# EAGLE board snowflake-hw-v0.0.2 R5 (EAGLE 9.2.2)
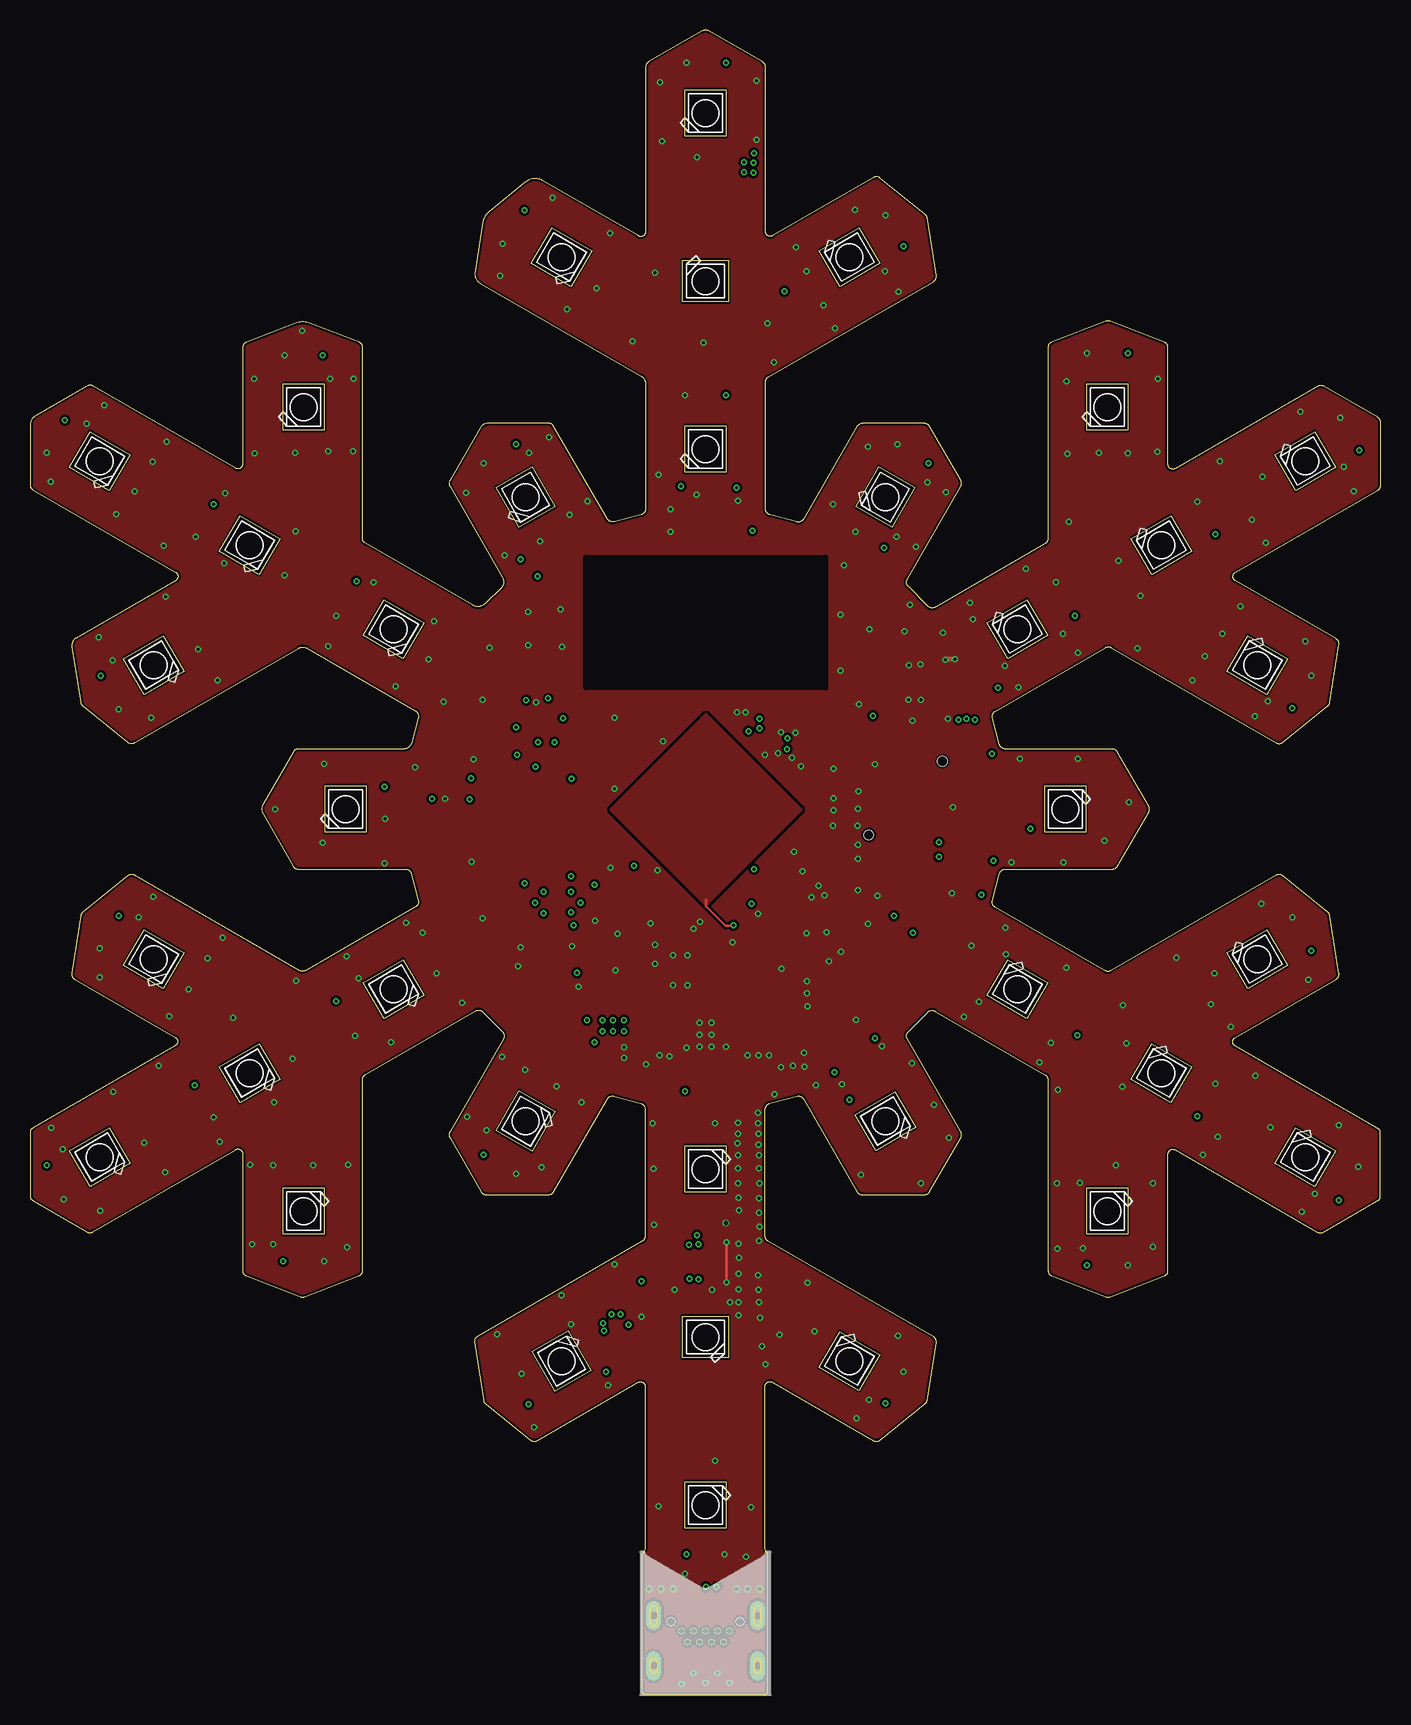
[diagram p2: board, top side]
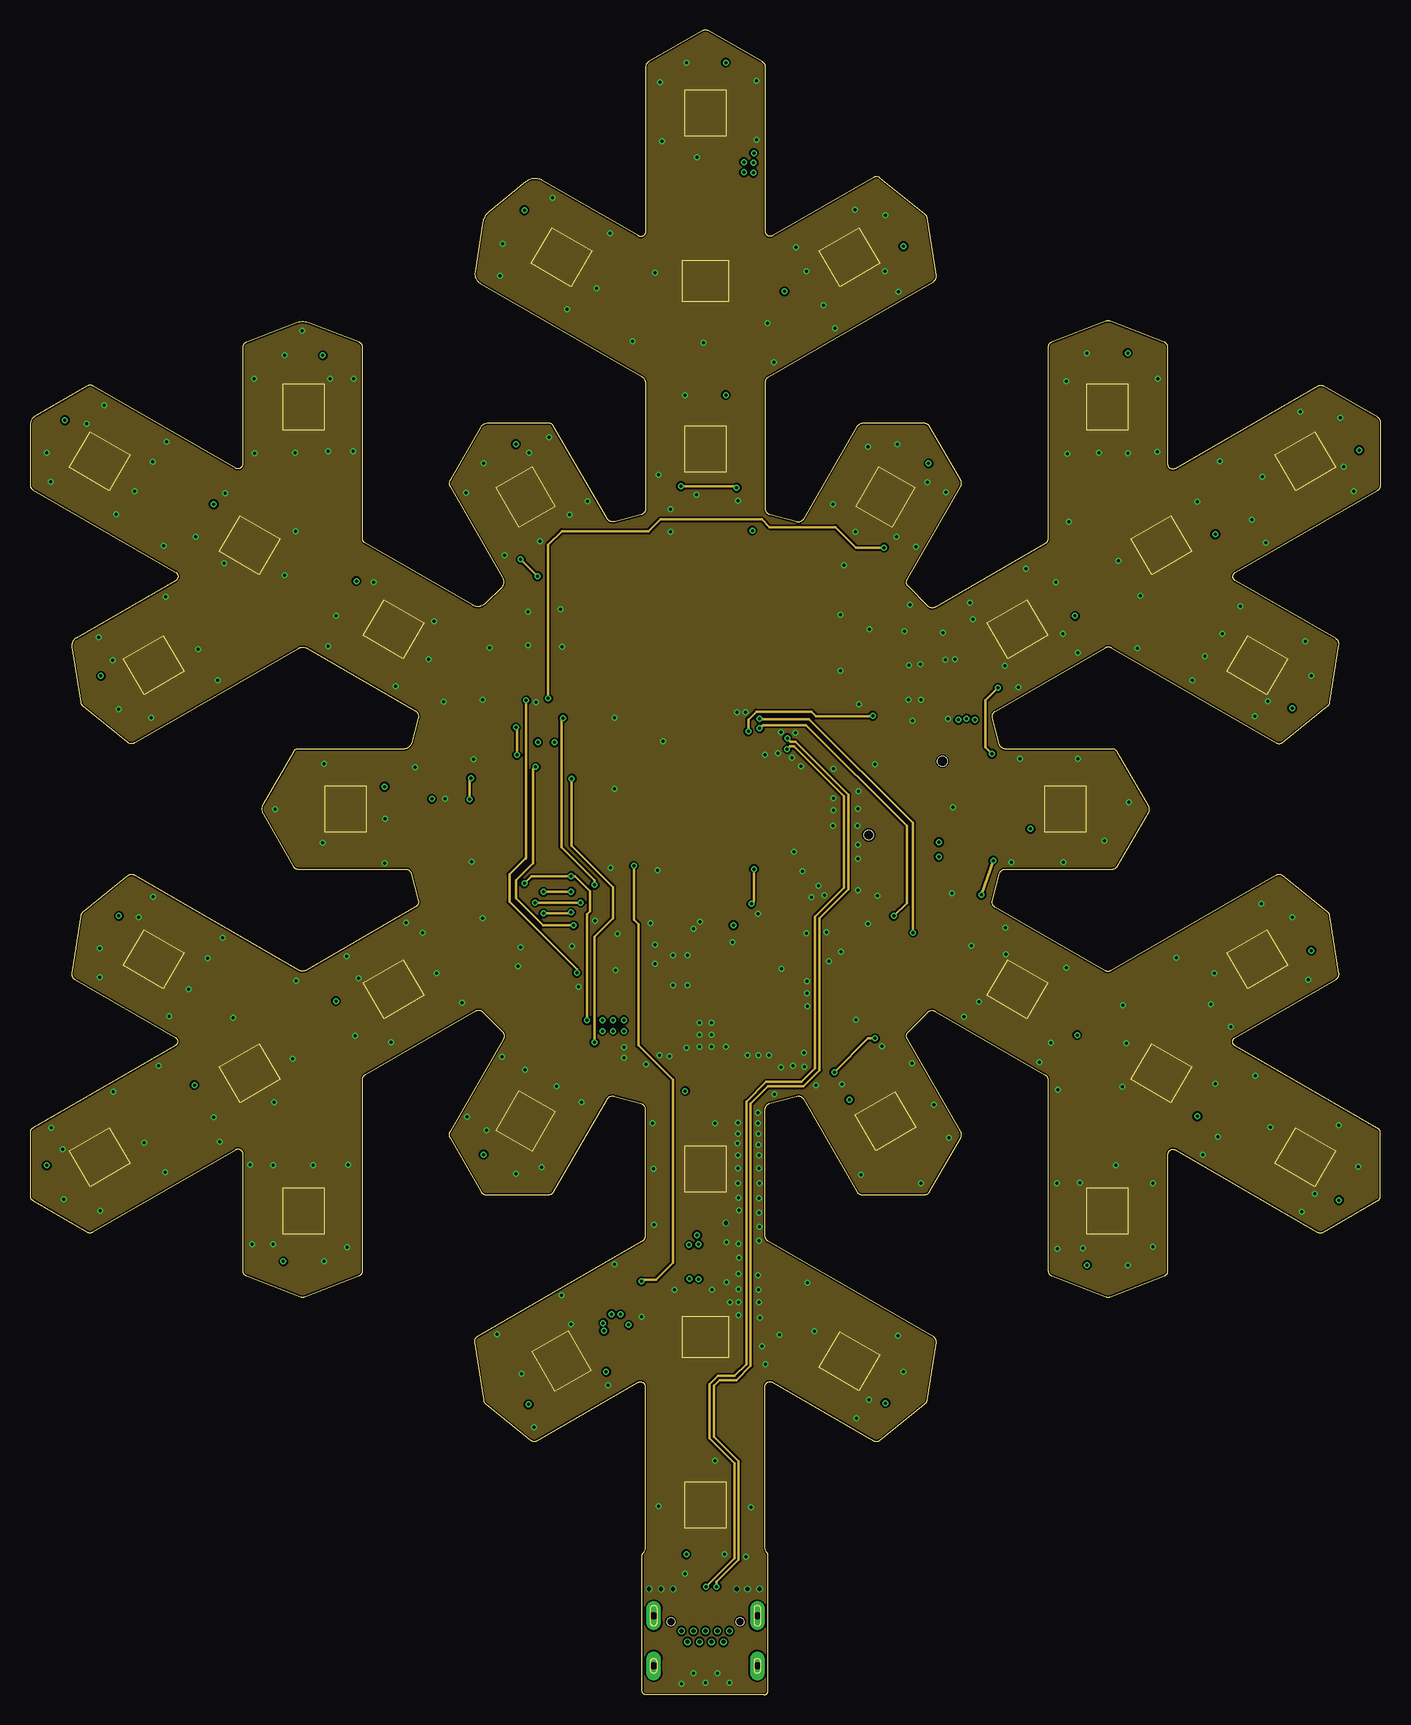
[diagram p3: board, inner layer Route2]
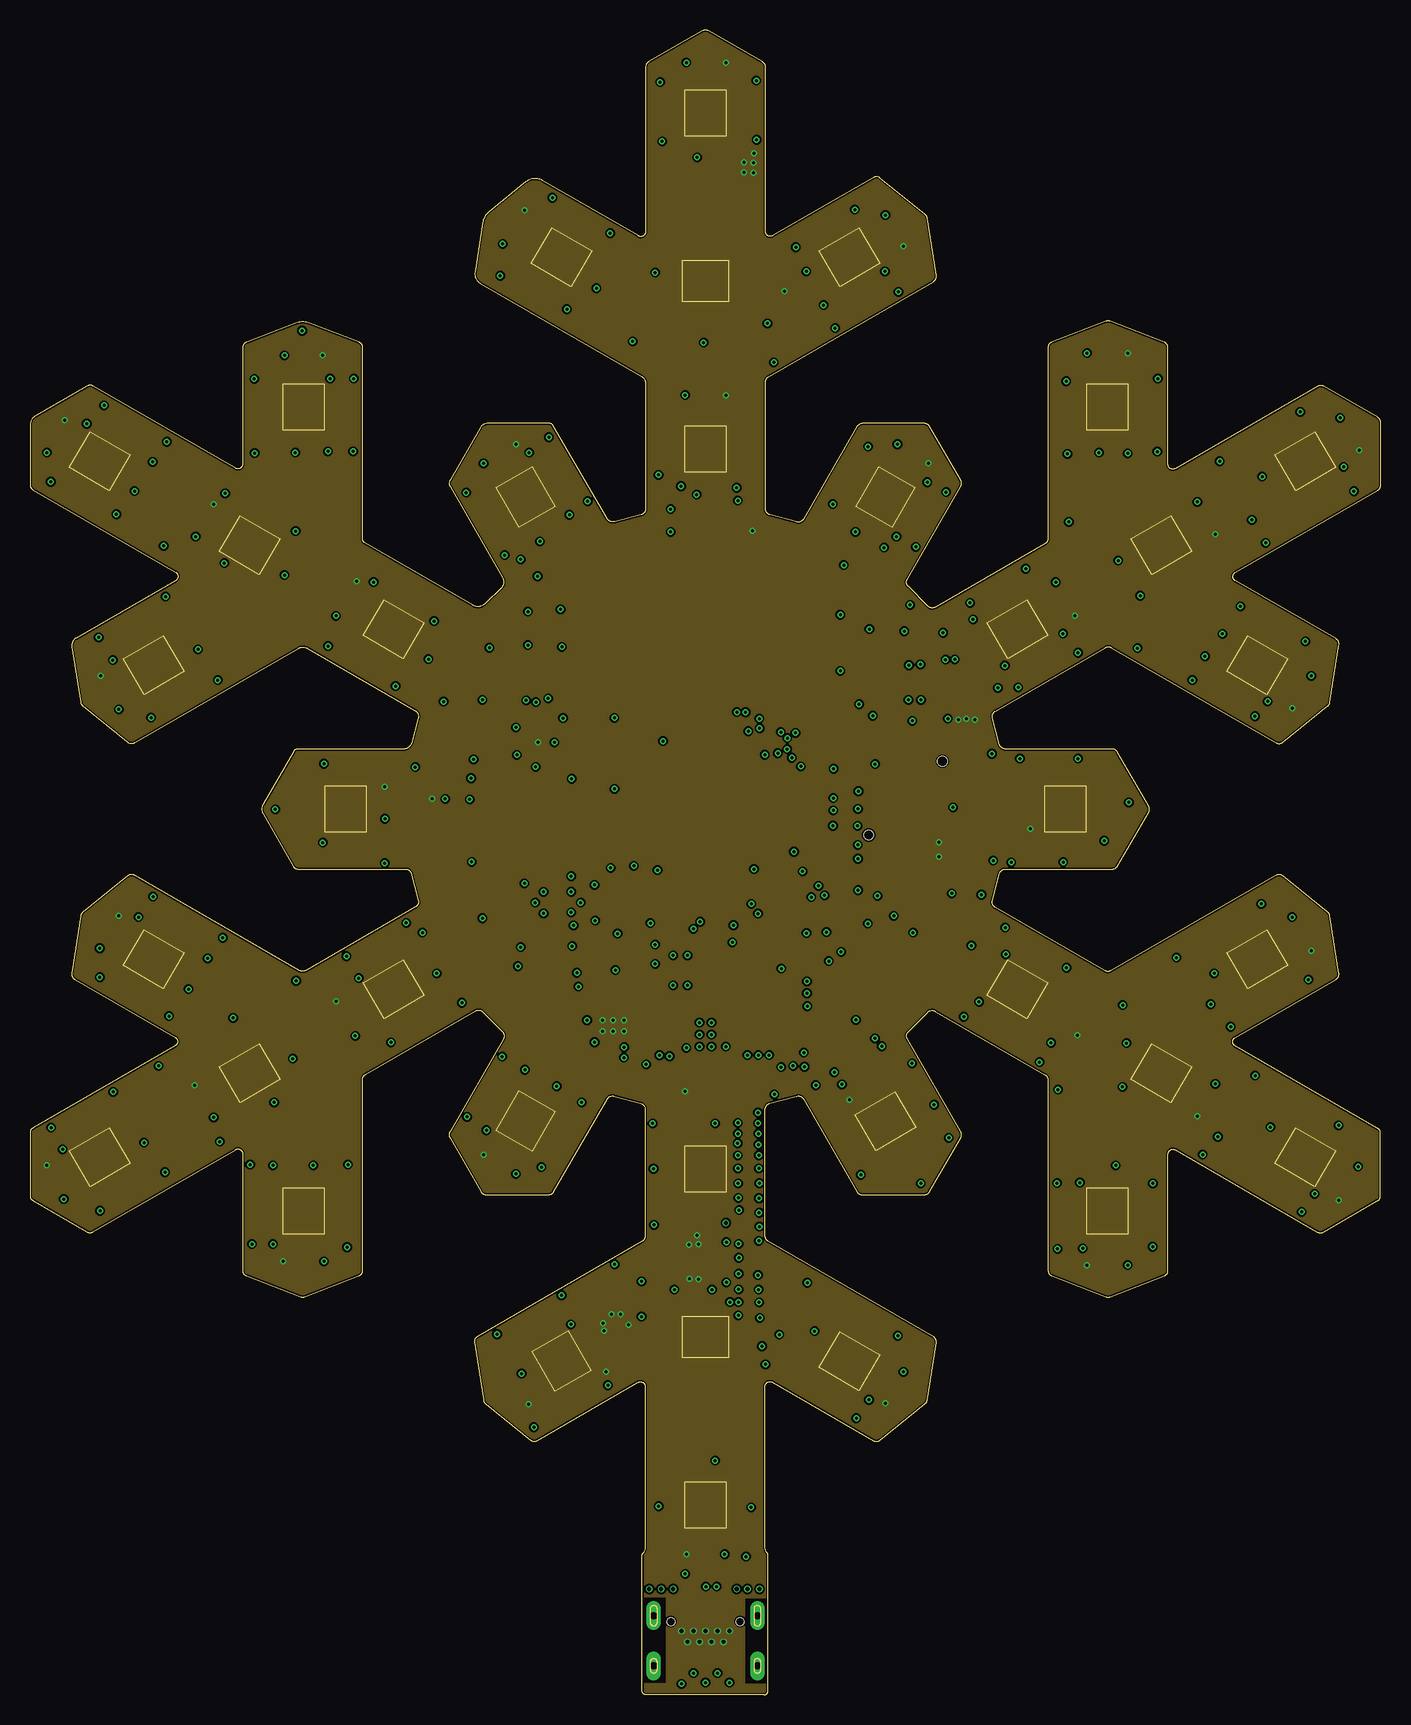
[diagram p4: board, inner layer Route15]
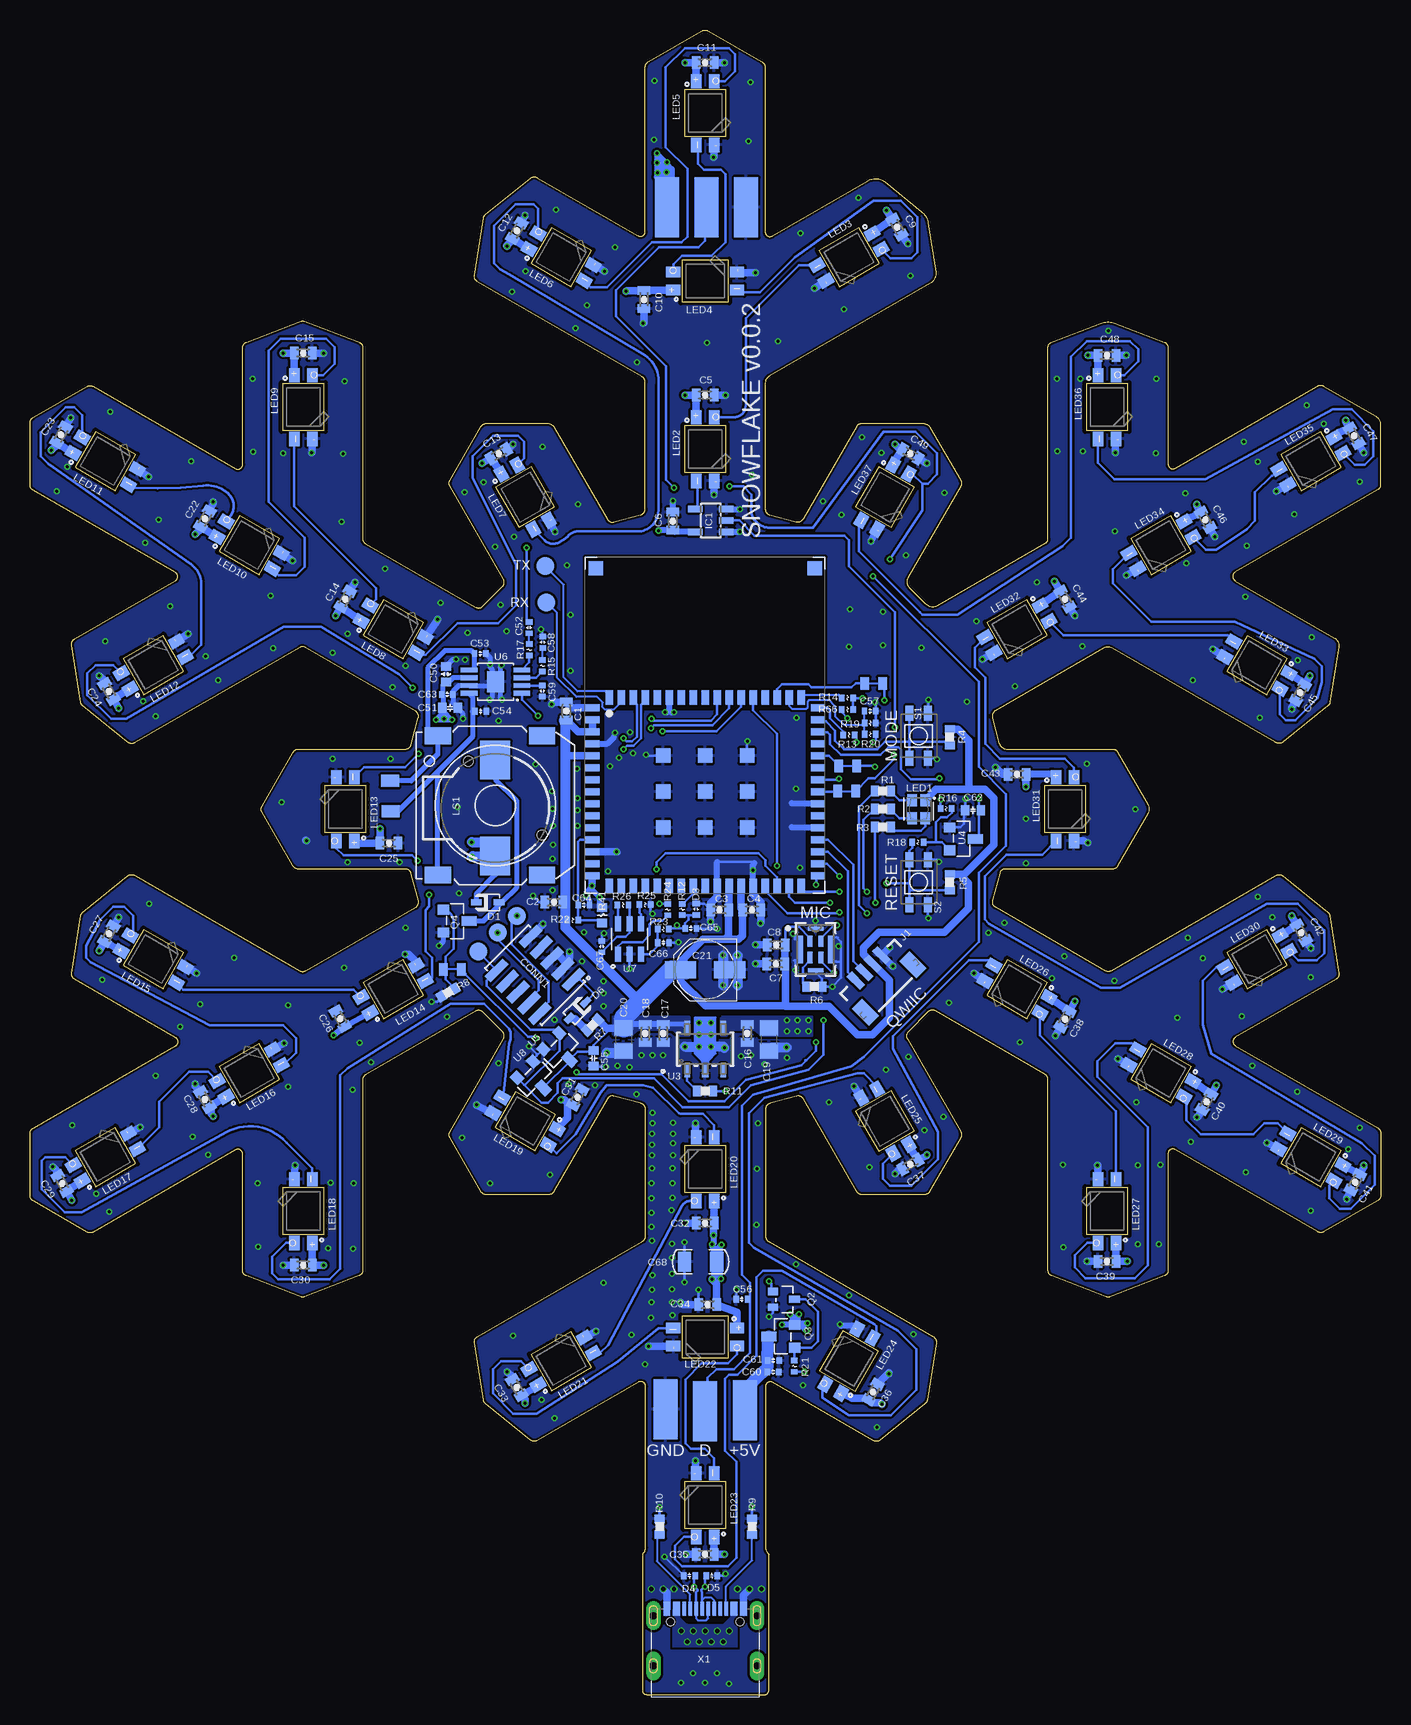
[diagram p5: board, bottom side, seen from below]

Size 112.6 x 138.75 mm. Coordinates in mm from the lower left corner, seen from the top.
Outline: 244 segments
Copper layers (1+2*15+16): Top 0.018mm / dielectric 0.195mm / Route2 0.035mm / dielectric 1.1mm / Route15 0.035mm / dielectric 0.195mm / Bottom 0.018mm
Design rules "particle-4layer *": minimum track width 6mil, minimum drill 0.25mm, track to track 6mil, track to pad 6mil, pad to pad 6mil, via to via 6mil, smd to smd 0mil, copper to edge 6mil, drill to drill 6mil, minimum pad ring 12mil, minimum via ring 4mil, stop-mask expansion 0.01mm, vias tented up to drill 20mil, thermal gap 8mil
Net classes: 0 default: width 0.152 mm, clearance 0.152 mm

## Footprints (pad centres in the part's own frame; a part is rotated, then mirrored left to right if it is on the bottom)
TP_2X5MM = smd 2 x 5: P$1 0,0
C0603_P = smd 0.711 x 1.041: 1 -0.749,0; 2 0.749,0
C0805 = smd 1.3 x 1.5: 1 -0.95,0; 2 0.95,0
PANASONIC_C = smd 2.6 x 1.4: + 2.05,0; - -2.05,0
C0603 = smd 0.7 x 0.85: 1 -0.65,0; 2 0.65,0
C-0603A = smd 0.7 x 0.85: 1 -0.65,0; 2 0.65,0
C-0402 = smd 0.45 x 0.55: 1 -0.47,0; 2 0.47,0
C1206 = smd 1.1 x 1.65: 1 -1.35,0; 2 1.35,0
CONN5X2_1.27 = smd 0.7 x 2.1: 1 -2.54,-2; 2 -2.54,2; 3 -1.27,-2; 4 -1.27,2; 5 0,-2; 6 0,2; 7 1.27,-2; 8 1.27,2; 9 2.54,-2; 10 2.54,2
SOD-323 = smd 0.9 x 0.5: 1 -0.95,0; 2 0.95,0
C0402 = smd 0.45 x 0.6: 1 -0.47,0; 2 0.47,0
SOT23-5L = smd 0.55 x 1.2: 1 -0.95,-1.3; 2 0,-1.3; 3 0.95,-1.3; 4 0.95,1.3; 5 -0.95,1.3
JST04_1MM_VERT = smd 0.6 x 1.55: 1 -1.5,0.775; 2 -0.5,0.775; 3 0.5,0.775; 4 1.5,0.775 | smd 1.2 x 2: NC1 -2.8,3.2; NC2 2.8,3.2
PLCC4-2MM-RGB = smd 1 x 0.8: BLUE -0.75,-0.55; CA 0.75,-0.55; GREEN -0.75,0.55; RED 0.75,0.55
NEO3535_REVERSE = smd 1.2 x 0.9 bottom: 1-VDD 2.65,-0.75; 2-DOUT 2.65,0.75; 3-GND -2.65,0.75; 4-DIN -2.65,-0.75
BUZZER-CCV = smd 3.2 x 2.5: + 4,0; - -4,0 | hole 0.8: -3.9,-2.25; 2.25,3.9
SOT323 = smd 0.6 x 0.8: 1 -0.65,-0.95; 2 0.65,-0.95 | smd 0.6 x 0.9: 3 0,0.85
SOT-23 = smd 0.8 x 0.95: 1 -0.95,-1; 2 0.95,-1 | smd 0.8 x 1.25: 3 0,1.15
R0603_P = smd 0.7 x 0.85: 1 -0.65,0; 2 0.65,0
R-0402S = smd 0.45 x 0.55: 1 -0.47,0; 2 0.47,0
R-0603A = smd 0.7 x 0.85: 1 -0.65,0; 2 0.65,0
TACTILE_SWITCH_SMD = smd 1.25 x 0.65: 1 -1.875,0.775; 2 1.875,0.775; 3 -1.875,-0.775; 4 1.875,-0.775
TP = smd 1.5 x 1.5: TP 0,0
TP-1.0X1.5 = smd 1.5 x 1: P$1 0,0
P2 = smd 1.2 x 0.6: 1 -9.4,2.45; 2 -9.4,1.45; 3 -9.4,0.45; 4 -9.4,-0.55; 5 -9.4,-1.55; 6 -9.4,-2.55; 7 -9.4,-3.55; 8 -9.4,-4.55; 9 -9.4,-5.55; 10 -9.4,-6.55; 11 -9.4,-7.55; 12 -9.4,-8.55; 13 -9.4,-9.55; 14 -9.4,-10.55; 15 -9.4,-11.55; 33 9.4,-11.55; 34 9.4,-10.55; 35 9.4,-9.55; 36 9.4,-8.55; 37 9.4,-7.55; 38 9.4,-6.55; 39 9.4,-5.55; 40 9.4,-4.55; 41 9.4,-3.55; 42 9.4,-2.55; 43 9.4,-1.55; 44 9.4,-0.55; 45 9.4,0.45; 46 9.4,1.45; 47 9.4,2.45 | smd 0.6 x 1.2: 16 -8,-12.4; 17 -7,-12.4; 18 -6,-12.4; 19 -5,-12.4; 20 -4,-12.4; 21 -3,-12.4; 22 -2,-12.4; 23 -1,-12.4; 24 0,-12.4; 25 1,-12.4; 26 2,-12.4; 27 3,-12.4; 28 4,-12.4; 29 5,-12.4; 30 6,-12.4; 31 7,-12.4; 32 8,-12.4; 48 8,3.3; 49 7,3.3; 50 6,3.3; 51 5,3.3; 52 4,3.3; 53 3,3.3; 54 2,3.3; 55 1,3.3; 56 0,3.3; 57 -1,3.3; 58 -2,3.3; 59 -3,3.3; 60 -4,3.3; 61 -5,3.3; 62 -6,3.3; 63 -7,3.3; 64 -8,3.3 | smd 1.2 x 1.2: 65 -3.5,-1.55; 66 -3.5,-4.55; 67 -3.5,-7.55; 68 0,-1.55; 69 0,-4.55; 70 0,-7.55; 71 3.5,-1.55; 72 3.5,-4.55; 73 3.5,-7.55; 74 9.12,14.07; 75 -9.12,14.07
MP34DT05TR-A_STM = smd 0.406 x 0.94: 1 -0.45,0.675; 2 -0.45,-0.675; 3 0.45,-0.675; 4 0.45,0.675 | smd 1.295 x 0.356: 5 0,1.725; 6 0,-1.725 | smd 0.356 x 2.311: 7 -1.225,0; 8 1.225,0
SOT-89-5_TOR-M = smd 0.483 x 1.118: 1 -1.5,-1.803; 3 1.5,-1.803; 4 1.5,1.803; 5 -1.5,1.803 | smd 0.533 x 1.118: 2 0,-1.803
MSOP-8 = smd 1.4 x 0.4: 1 -2.2,0.975; 2 -2.2,0.325; 3 -2.2,-0.325; 4 -2.2,-0.975; 5 2.2,-0.975; 6 2.2,-0.325; 7 2.2,0.325; 8 2.2,0.975 | smd 1.425 x 1.76: 9 0,0
SOT-23-6 = smd 1.27 x 0.508: 1 -1.27,0.953; 2 -1.27,0; 3 -1.27,-0.953; 4 1.27,-0.953; 5 1.27,0; 6 1.27,0.953
KJL-01304T(13X13MM) = smd 1.4 x 2.2: LEAD+ -5.8,-4.8; LEAD- 5.8,-4.8; P$1 -5.8,3.9; P$2 5.8,3.9
JMP_0603_NC = smd 0.711 x 1.041: 1 -0.749,0; 2 0.749,0
USB_C_CUSB31-CFM2AX-01-X = smd 0.575 x 1.15: A1B12 -3.2,7.355; A4B9 -2.4,7.355; B1A12 3.2,7.355; B4A9 2.4,7.355 | smd 0.275 x 1.15: A5 -1.25,7.355; A6 -0.25,7.355; A7 0.25,7.355; A8 1.25,7.355; B5 1.75,7.355; B6 0.75,7.355; B7 -0.75,7.355; B8 -1.75,7.355 | drill 0.6 pad 1 long: M1 -4.32,6.78; M2 4.32,6.78; M3 -4.32,2.6; M4 4.32,2.6 | hole 0.65: 2.89,6.28; -2.89,6.28

## Placement (x,y rotation side)
+5V  TP2X5MM  [TP_2X5MM]  59.5,123.96 0 bottom
+5V_EX  TP2X5MM  [TP_2X5MM]  53.01,23.73 0 bottom
C1  0.1uF, 16V  [C0603_P]  67.88,82 90 bottom
C2  0.1uF, 16V  [C0603_P]  68.91,66.07 180 bottom
C3  0.1uF, 16V  [C0603_P]  55.11,65.43 180 bottom
C4  0.1uF, 16V  [C0603_P]  52.41,65.43 0 bottom
C5  0.1uF, 16V  [C0603_P]  56.31,108.33 180 bottom
C6  0.1uF, 16V  [C0603_P]  59.01,97.83 270 bottom
C7  0.1uF, 16V  [C0603_P]  50.41,60.93 180 bottom
C8  10uF, 16V  [C0603_P]  50.38,62.5 180 bottom
C9  0.1uF, 16V  [C0603_P]  40.31,122.33 120 bottom
C10  0.1uF, 16V  [C0603_P]  61.41,116.29 90 bottom
C11  0.1uF, 16V  [C0603_P]  56.31,136.03 180 bottom
C12  0.1uF, 16V  [C0603_P]  72.01,122.03 240 bottom
C13  0.1uF, 16V  [C0603_P]  73.51,103.43 210 bottom
C14  0.1uF, 16V  [C0603_P]  86.31,91.33 240 bottom
C15  0.1uF, 16V  [C0603_P]  89.81,111.83 180 bottom
C16  0.1uF, 16V  [C0603_P]  52.81,55.13 90 bottom
C17  0.1uF, 16V  [C0603_P]  59.81,55.13 90 bottom
C18  0.01uF, 16V  [C0603_P]  61.31,55.13 270 bottom
C19  22uF, 10V  [C0805]  51.01,54.63 270 bottom
C20  22uF, 10V  [C0805]  63.11,54.63 270 bottom
C21  100uF, 6.3V  [PANASONIC_C]  56.31,60.43 180 bottom
C22  0.1uF, 16V  [C0603_P]  98.01,98.03 240 bottom
C23  0.1uF, 16V  [C0603_P]  110.01,105.03 240 bottom
C24  0.1uF, 16V  [C0603_P]  106.01,83.63 300 bottom
C25  0.1uF, 16V  [C0603_P]  82.66,70.99 180 bottom
C26  0.1uF, 16V  [C0603_P]  86.73,56.35 300 bottom
C27  0.1uF, 16V  [C0603_P]  106.01,63.43 240 bottom
C28  0.1uF, 16V  [C0603_P]  98.01,49.63 300 bottom
C29  0.1uF, 16V  [C0603_P]  109.91,42.63 300 bottom
C30  0.1uF, 16V  [C0603_P]  89.81,35.83 0 bottom
C31  0.1uF, 16V  [C0603_P]  66.95,49.82 240 bottom
C32  0.1uF, 16V  [C0603_P]  56.31,39.33 0 bottom
C33  0.1uF, 16V  [C0603_P]  72.01,25.63 300 bottom
C34  0.1uF, 16V  [C0603_P]  56.1,32.53 0 bottom
C35  0.1uF, 16V  [C0603_P]  56.31,11.73 0 bottom
C36  0.1uF, 16V  [C0603_P]  42.32,25.25 240 bottom
C37  0.1uF, 16V  [C0603_P]  39.21,44.23 30 bottom
C38  0.1uF, 16V  [C0603_P]  26.31,56.33 60 bottom
C39  0.1uF, 16V  [C0603_P]  22.81,36.13 0 bottom
C40  0.1uF, 16V  [C0603_P]  14.51,49.43 60 bottom
C41  0.1uF, 16V  [C0603_P]  2.12,42.73 60 bottom
C42  0.1uF, 16V  [C0603_P]  6.61,63.53 120 bottom
C43  0.1uF, 16V  [C0603_P]  30.31,76.73 0 bottom
C44  0.1uF, 16V  [C0603_P]  26.31,91.33 120 bottom
C45  0.1uF, 16V  [C0603_P]  6.71,83.53 60 bottom
C46  0.1uF, 16V  [C0603_P]  14.61,97.93 120 bottom
C47  0.1uF, 16V  [C0603_P]  2.21,104.93 120 bottom
C48  0.1uF, 16V  [C0603_P]  22.81,111.63 180 bottom
C49  0.1uF, 16V  [C0603_P]  39.21,103.43 150 bottom
C50  0.1uF  [C0603]  77.91,85.07 90 bottom
C51  10uF  [C-0603A]  77.58,82.26 0 bottom
C52  1uF  [C-0402]  70.99,88.95 90 bottom
C53  nc  [C-0402]  75.06,86.78 180 bottom
C54  nc  [C-0402]  75.03,81.98 0 bottom
C55  0.1uF  [C-0603A]  65.62,53.07 90 bottom
C56  10pF  [C-0402]  53.25,32.98 0 bottom
C57  1000pF  [C-0402]  42.56,81.99 180 bottom
C58  1uF  [C-0402]  69.86,87.73 90 bottom
C59  0.22uF  [C-0402]  69.88,83.67 270 bottom
C60  0.1uF  [C-0402]  50.65,26.92 180 bottom
C61  1000F  [C-0402]  50.62,27.87 180 bottom
C62  0.1uF  [C-0603A]  33.97,73.73 0 bottom
C63  1000pF  [C-0402]  77.81,83.39 0 bottom
C64  1000PF  [C-0402]  66.42,65.82 180 bottom
C65  NC  [C-0402]  57.5,63.89 0 bottom
C66  33P  [C-0402]  59.79,62.69 180 bottom
C67  0.1uF  [C-0402]  64.92,62.37 270 bottom
C68  100uF  [C1206]  56.69,36.1 180 bottom
CONN1  CONN5X2  [CONN5X2_1.27]  70.49,60 135 bottom
D1  nc  [SOD-323]  74.43,66.05 180 bottom
D3  LXES15AAA1-133  [C0402]  57.06,65.48 90 bottom
D4  nc  [C0402]  57.62,9.94 180 bottom
D5  nc  [C0402]  55.76,9.94 0 bottom
D6  LRB551V-30  [SOD-323]  66.94,57.07 45 bottom
DATA  TP2X5MM  [TP_2X5MM]  56.31,23.65 0 bottom
DATA1  TP2X5MM  [TP_2X5MM]  56.2,123.96 0 bottom
GND  TP2X5MM  [TP_2X5MM]  59.61,23.81 0 bottom
GND115  TP2X5MM  [TP_2X5MM]  52.9,123.96 0 bottom
IC1  74AHC1G125  [SOT23-5L]  55.84,97.88 90 bottom
J1  [JST04_1MM_VERT]  43.24,61.14 225 bottom
LED1  RGB-LED-CLMVB-FKARGB  [PLCC4-2MM-RGB]  38.51,73.83 90 bottom
LED2  WS2812B_SK6812E  [NEO3535_REVERSE]  56.31,103.83 90 top
LED3  WS2812B_SK6812E  [NEO3535_REVERSE]  44.31,119.83 150 top
LED4  WS2812B_SK6812E  [NEO3535_REVERSE]  56.31,117.83 0 top
LED5  WS2812B_SK6812E  [NEO3535_REVERSE]  56.31,131.83 90 top
LED6  WS2812B_SK6812E  [NEO3535_REVERSE]  68.31,119.83 30 top
LED7  WS2812B_SK6812E  [NEO3535_REVERSE]  71.31,99.83 60 top
LED8  WS2812B_SK6812E  [NEO3535_REVERSE]  82.31,88.83 30 top
LED9  WS2812B_SK6812E  [NEO3535_REVERSE]  89.81,107.33 90 top
LED10  WS2812B_SK6812E  [NEO3535_REVERSE]  94.31,95.83 30 top
LED11  WS2812B_SK6812E  [NEO3535_REVERSE]  106.31,102.83 30 top
LED12  WS2812B_SK6812E  [NEO3535_REVERSE]  102.31,85.83 330 top
LED13  WS2812B_SK6812E  [NEO3535_REVERSE]  86.31,73.83 270 top
LED14  WS2812B_SK6812E  [NEO3535_REVERSE]  82.31,58.83 330 top
LED15  WS2812B_SK6812E  [NEO3535_REVERSE]  102.31,61.33 30 top
LED16  WS2812B_SK6812E  [NEO3535_REVERSE]  94.31,51.83 330 top
LED17  WS2812B_SK6812E  [NEO3535_REVERSE]  106.31,44.83 330 top
LED18  WS2812B_SK6812E  [NEO3535_REVERSE]  89.81,40.33 270 top
LED19  WS2812B_SK6812E  [NEO3535_REVERSE]  71.31,47.83 210 top
LED20  WS2812B_SK6812E  [NEO3535_REVERSE]  56.31,43.83 270 top
LED21  WS2812B_SK6812E  [NEO3535_REVERSE]  68.31,27.83 330 top
LED22  WS2812B_SK6812E  [NEO3535_REVERSE]  56.31,29.83 180 top
LED23  WS2812B_SK6812E  [NEO3535_REVERSE]  56.31,15.83 270 top
LED24  WS2812B_SK6812E  [NEO3535_REVERSE]  44.31,27.83 300 top
LED25  WS2812B_SK6812E  [NEO3535_REVERSE]  41.31,47.83 240 top
LED26  WS2812B_SK6812E  [NEO3535_REVERSE]  30.31,58.83 210 top
LED27  WS2812B_SK6812E  [NEO3535_REVERSE]  22.81,40.33 270 top
LED28  WS2812B_SK6812E  [NEO3535_REVERSE]  18.31,51.83 210 top
LED29  WS2812B_SK6812E  [NEO3535_REVERSE]  5.81,44.83 210 top
LED30  WS2812B_SK6812E  [NEO3535_REVERSE]  10.31,61.33 150 top
LED31  WS2812B_SK6812E  [NEO3535_REVERSE]  26.31,73.83 90 top
LED32  WS2812B_SK6812E  [NEO3535_REVERSE]  30.31,88.83 150 top
LED33  WS2812B_SK6812E  [NEO3535_REVERSE]  10.31,85.83 210 top
LED34  WS2812B_SK6812E  [NEO3535_REVERSE]  18.31,95.83 150 top
LED35  WS2812B_SK6812E  [NEO3535_REVERSE]  5.81,102.83 150 top
LED36  WS2812B_SK6812E  [NEO3535_REVERSE]  22.81,107.33 90 top
LED37  WS2812B_SK6812E  [NEO3535_REVERSE]  41.31,99.83 120 top
LS1  nc  [BUZZER-CCV]  73.81,73.91 270 bottom
Q2  2N7002  [SOT323]  49.71,32.97 270 bottom
Q3  IRLML6401  [SOT-23]  49.85,29.89 90 bottom
Q4  nc  [SOT-23]  77.15,64.49 270 bottom
R1  1K  [R0603_P]  41.51,75.33 180 bottom
R2  1K  [R0603_P]  41.51,73.83 180 bottom
R3  1K  [R0603_P]  41.51,72.33 180 bottom
R4  10K  [R0603_P]  35.91,79.83 90 bottom
R5  nc  [R0603_P]  35.91,67.73 90 bottom
R6  10K  [R0603_P]  47.21,59.03 180 bottom
R7  1K  [R0603_P]  65.71,55.83 45 bottom
R8  nc  [R0603_P]  77.74,58.54 30 bottom
R9  5K1  [R0603_P]  52.41,14.03 270 bottom
R10  5K1  [R0603_P]  60.11,14.03 270 bottom
R11  100K  [R0603_P]  56.31,50.33 0 bottom
R12  NC  [R-0402S]  58.23,65.46 270 bottom
R13  NC  [R-0402S]  44.33,80 0 bottom
R14  1K  [R-0402S]  44.45,83.1 0 bottom
R15  40.2k  [R-0402S]  69.87,85.77 270 bottom
R16  NC  [R-0402S]  36.22,73.86 180 bottom
R17  40.2k  [R-0402S]  70.97,87.1 270 bottom
R18  0R  [R-0402S]  38.57,71.06 180 bottom
R19  10K  [R-0402S]  42.55,80.99 180 bottom
R20  10K  [R-0402S]  42.55,80.06 0 bottom
R21  10K  [R-0402S]  48.87,27.41 270 bottom
R22  10K  [R-0402S]  67.35,64.57 0 bottom
R23  2K  [R-0402S]  59.8,63.82 180 bottom
R24  0R  [R-0402S]  59.43,65.45 270 bottom
R25  0R  [R-0402S]  61.33,65.86 0 bottom
R26  10K  [R-0402S]  63.17,65.83 0 bottom
R41  NCP18WF104F12RB  [R-0603A]  64.9,64.99 90 bottom
R66  1K  [R-0402S]  44.45,82.13 0 bottom
S1  [TACTILE_SWITCH_SMD]  38.51,79.93 90 bottom
S2  [TACTILE_SWITCH_SMD]  38.51,67.73 90 bottom
TP1  TP-1.5MM  [TP]  75.23,61.98 90 bottom
TP5  TP-1.5MM  [TP]  69.65,94.08 0 bottom
TP6  TP-1.5MM  [TP]  69.57,91.04 0 bottom
TP7  TP-1.5MM  [TP]  73.61,63.53 90 bottom
TP8  TP-1.5MM  [TP]  72.01,64.93 90 bottom
TP9  TP1.0X1.5  [TP-1.0X1.5]  82.55,73.66 0 bottom
TP10  TP1.0X1.5  [TP-1.0X1.5]  82.58,76.18 0 bottom
U1  P2  [P2]  56.31,79.83 0 bottom
U2  MP34DT05TR-A  [MP34DT05TR-A_STM]  47.11,62.13 0 bottom
U3  XC6220B331PR-G  [SOT-89-5_TOR-M]  56.31,53.83 0 bottom
U4  APX803L20-41SA  [SOT-23]  34.92,71.35 270 bottom
U5  RT9818C-30GV  [SOT-23]  68.43,53.78 225 bottom
U6  TPA6211A1  [MSOP-8]  73.79,84.45 180 bottom
U7  PT2041A  [SOT-23-6]  62.61,63 90 bottom
U8  NC  [SOT-23]  70.62,51.41 225 bottom
U$1  SEPAKER  [KJL-01304T(13X13MM)]  73.81,74.13 270 bottom
U$2  JMP_0603_NC  [JMP_0603_NC]  77.4,60.48 180 bottom
U$3  JMP_0603_NC  [JMP_0603_NC]  44.41,77.43 0 bottom
U$4  JMP_0603_NC  [JMP_0603_NC]  42.26,84.31 0 bottom
U$15  JMP_0603_NC  [JMP_0603_NC]  44.51,75.33 0 bottom
X1  [USB_C_CUSB31-CFM2AX-01-X]  56.31,-0.17 0 bottom

## Tracks (layer width: path | path; a pad name or v marks a point on that pad's centre or on a via)
+3V3
  Bottom 0.203: C8.1 49.63,63.82 49.44,64.01 48.49,64.01 47.56,63.08 U2.1 | R26.2 62.61,65.74 U7.5 62.61,63.52 62.93,63.2 63.66,63.2 64.92,61.94 C67.2 64.92,60.91 | 66.35,53.59 66.18,53.62 | 66.18,53.62 C55.2 65.62,54.13 64.17,55.58 C20.1 | R22.1 67.95,64.86 | R22.1 67.95,64.57 | C1.1 67.95,81.08 | 66.18,53.62 66.96,53.62 U5.3 67.62,52.78 U8.3 | R22.1 67.82,64.84 67.95,64.97 | C2.1 68.04,65.95 67.95,65.95 C2.1
  Bottom 0.406: U3.5 58.06,55.88 C17.2
  Bottom 0.508: 67.51,78.28 67.89,78.28 67.95,78.34 | C17.2 C18.1 62.81,55.88 C20.1
  Bottom 0.61: C1.1 66.91,80.28 U1.3 U1.2 | U1.27 53.31,65.58 C4.1 53.21,65.38 53.21,63.29 53.53,62.97 54.67,62.97 | U1.26 54.31,65.48 C3.1 54.36,63.28 54.67,62.97 | 54.67,62.97 54.77,62.97 54.78,62.96 56.51,62.96 58.36,61.11 C21.+ 58.36,59.49 56.29,57.42 49.61,57.42 | R7.2 64.54,55.58 C20.1 | U1.5 67.51,78.28 | 34.31,75.46 34.31,79.53 35.26,80.48 R4.2 | LED1.CA 37.08,75.46 34.31,75.46 | 49.61,57.42 49.61,57.4 45.98,57.4 43.61,55.03 42.37,55.03 40.97,56.42 40.97,59.58 J1.2 43.11,61.72 43.11,62.27 41.82,63.56 36.38,63.56 34.37,65.57 34.37,67.66 35.09,68.38 R5.2 34.71,68.38 32.23,70.86 32.23,74.72 32.97,75.46 34.31,75.46 | 49.61,57.42 49.61,60.88 C7.1 49.66,62.47 C8.1
  Bottom 0.813: 67.95,64.86 67.95,63.95 64.92,60.91 62.06,58.05 61.5,58.05 | 67.95,64.97 67.95,65.95 67.95,78.34 67.95,81.08 68.09,81.22
  Bottom 1.6: C20.1 63.11,56.44 61.5,58.05 59.12,60.43 C21.+ 57.91,60.43
  pour Bottom (isolate 0.1, no thermals): 58.96,55.41 58.99,55.43 61.93,55.43 61.97,55.41 62.46,54.93 63.87,54.93 64.01,55.07 64.01,56.53 57.66,56.53 57.62,56.49 57.62,54.97 57.66,54.93 58.47,54.93
+5V  (via drill 0.25 pad 0.5, 0.35)
  Top 0.4: 78.72,81.24 v78.75,81.27
  Bottom 0.152: v68.31,49.61 67.77,49.61 C31.2 | C37.2 38.22,44.6 37.87,44.95 | C49.2 40.29,104.23 v40.51,104.23 | C13.2 74.49,103.05 v74.91,102.63 | LED34.1-VDD 16.08,98.12 15.95,98.12 | LED7.1-VDD | LED7.1-VDD 73.29,101.78 | LED12.1-VDD 104.37,83.85 | LED10.1-VDD 97.12,96.5 | LED11.1-VDD 109.12,103.5 | LED17.1-VDD | LED15.1-VDD | LED3.1-VDD | LED28.1-VDD | LED25.1-VDD | LED26.1-VDD | LED37.1-VDD | LED33.1-VDD | LED21.1-VDD | LED35.1-VDD | LED32.1-VDD | LED8.1-VDD | LED29.1-VDD | LED6.1-VDD
  Bottom 0.203: v54.61,50.33 R11.2 | LED30.1-VDD 8.26,63.3 | LED16.1-VDD 96.37,49.85 | R20.2 42.08,79.65 v42.34,79.39 | R21.2 v48.03,26.94 | U4.3 33.51,71.61 33.51,73.96 | C62.2 33.32,73.77 33.51,73.96 | v33.51,74.68 33.51,73.96
  Bottom 0.4: U6.6 77.31,84.77 77.67,84.42 C50.1 78.17,84.16 78.17,83.32 | 78.17,83.32 78.25,83.39 C63.1 | 78.17,83.32 78.17,82.32 | 78.17,82.32 C51.1 | 78.17,82.32 78.17,81.96 77.47,81.26 v77.39,81.26 v78.74,81.26 v78.75,81.27 78.24,81.78 78.24,82 78.07,81.83 v78.07,81.37
  Bottom 0.406: LS1.+ 73.81,68.34 75.38,66.77 D1.2
  Bottom 0.508: IC1.5 58.86,96.93 C6.2 60.16,97.08 v60.21,97.03 | Q3.2 48.51,30.84 48.51,30.99 v47.78,30.99 | v48.48,31.73 48.6,31.61 48.6,31.09 Q3.2 | Q3.2 48.34,30.84 v47.85,30.35 | v49.22,31.71 49.04,31.53 49.04,31.03 Q3.2 | Q3.2 v49.9,30.84 | LED14.1-VDD C26.2 v87.29,55 | v54.95,37.51 55.13,37.33 55.13,36.31 C68.1 | C68.1 55.61,36.37 55.61,37.26 55.72,37.37 v55.72,37.55 55.6,37.67 v55.6,38.31 | v54.98,34.68 55.1,34.8 55.1,35.52 55.39,35.81 55.39,36.05 C68.1 | C68.1 55.57,35.87 55.57,34.82 v55.73,34.66 v55.74,34.66 | +5V.P$1 59.1,124.36 59.1,127.16 59.5,127.56 v59.5,127.74 59.66,127.74 60.33,128.41 v60.33,128.5 60.33,126.51 60.16,126.34 | +5V.P$1 59.52,123.98 v59.52,126.89 | +5V.P$1 59.5,125.68 60.16,126.34 | v60.29,126.86 60.16,126.86 60.16,126.34 | +5V.P$1 59.5,126.2 59.69,126.39 59.69,127.09 60.29,127.69 v60.32,127.69
  Bottom 0.61: v58.01,108.33 C5.2 LED2.1-VDD | LED4.1-VDD 60.94,117.08 60.89,117.04 C10.2 62.49,117.04 62.5,117.03 62.83,117.03 v62.89,116.97 | v58.01,136.03 C11.2 LED5.1-VDD | v41.21,123.73 C9.2 LED3.1-VDD | v72.81,120.73 72.86,120.78 72.39,121.25 C12.2 71.12,120.5 LED6.1-VDD | 73.29,101.78 C13.2 v74.91,102.63 | v74.91,102.63 | v87.11,89.93 C14.2 LED8.1-VDD | 97.12,96.5 C22.2 98.39,97.15 v98.81,96.73 | 109.12,103.5 C23.2 110.39,104.15 v110.81,103.73 | 104.37,83.85 C24.2 v105.21,82.23 | LED13.1-VDD 85.42,71.03 85.42,70.99 C25.2 83.41,72.16 v83.39,72.18 | 96.37,49.85 C28.2 97.51,48.8 97.51,48.43 v97.31,48.23 | LED17.1-VDD 108.27,42.85 C29.2 v109.11,41.23 | v109.11,41.23 | v88.11,35.83 C30.2 LED18.1-VDD | LED19.1-VDD 68.64,47.23 67.77,48.1 67.77,49.35 68.03,49.61 v68.31,49.61 | v71.31,24.33 71.31,24.65 C33.2 70.5,25.58 LED21.1-VDD | LED20.1-VDD C32.2 55.6,39.29 v55.6,38.31 | LED22.1-VDD 53.66,31.92 C34.2 55.37,32.55 55.37,34.29 v55.74,34.66 | LED23.1-VDD C35.2 v54.71,11.73 | LED23.1-VDD | v41.56,24.22 41.69,24.35 42.45,24.35 C36.2 42.83,24.73 44.09,24.73 44.92,25.13 44.96,25.13 LED24.1-VDD | LED25.1-VDD 39.34,45.73 C37.2 37.87,44.95 v37.81,45.03 | v25.51,57.83 C38.2 LED26.1-VDD | v13.71,50.83 13.7,50.79 C40.2 LED28.1-VDD | 8.26,63.3 C42.2 7.41,64.87 v7.41,64.93 | v29.56,75.69 C43.2 27.36,76.78 LED31.1-VDD | 6.28,84.28 5.9,84.89 v5.91,84.93 | 6.28,84.28 C45.2 | LED33.1-VDD 6.28,84.28 | LED32.1-VDD C44.2 v27.21,92.83 | v15.31,99.23 15.31,99.1 C46.2 15.12,98.44 15.95,98.12 | v2.91,106.23 2.91,106.1 C47.2 3.47,105.23 LED35.1-VDD | v24.41,111.63 C48.2 LED36.1-VDD | LED36.1-VDD | LED37.1-VDD 40.64,102.68 C49.2 40.09,103.8 v40.51,104.23
  Bottom 0.61: v1.39,44.13 1.42,43.99 C41.2 LED29.1-VDD | v21.11,36.13 C39.2 LED27.1-VDD | LED27.1-VDD | v91.51,111.83 C15.2 LED9.1-VDD | LED15.1-VDD C27.2 v106.81,62.03
  Bottom 0.813: v75.77,71.07 74.89,71.07 73.81,69.99 LS1.+ 75.69,69.91 v75.75,69.85
  other vias: 56.31,5.33 54.81,4.43 56.81,4.43 58.31,5.33 54.31,5.33 55.81,4.43 57.31,5.33 57.81,4.43 55.31,5.33 49.51,56.23 49.51,55.33 48.61,56.23 48.61,55.33 47.71,56.23 47.71,55.33
  pour Bottom (isolate 0.1, no thermals): 54.03,55.43 54.07,55.41 54.56,54.93 54.97,54.93 55.01,54.97 55.01,56.39 54.87,56.53 47.42,56.53 47.42,54.93 51.67,54.93 52.16,55.41 52.19,55.43
  pour Bottom (isolate 0.1, no thermals): 54.8,5.85 54.77,5.86 54.15,6.48 54.14,6.51 54.14,7.75 53.69,7.75 53.69,4 58.94,4 58.94,7.75 58.49,7.75 58.49,6.51 58.48,6.48 57.86,5.86 57.83,5.85
  pour Route15 (isolate 0.15): -4.14,139.31 119.62,139.31 119.62,104.97 119.62,-3.6 -4.93,-3.6 -4.93,139.32 -4.13,139.32
  cutout Route15: 50.24,8.09 52.94,8.09 52.94,1.03 50.24,1.03
  cutout Route15: 59.67,8.02 62.28,8.02 62.28,6.76 62.28,0.96 59.67,0.96
A2_5V_MONITOR
  Bottom 0.152: U1.49 49.31,82.42 49.06,82.17 47.91,82.17 47.76,82.32 47.76,82.78 47.62,82.92 46,82.92 45.47,82.39 45.47,81.57 44.74,80.84 43.18,80.84 R19.2 43.03,81.89 | 43.03,81.89 C57.2 | R20.1 R19.2 43.02,81.88 43.03,81.89
BUFF_OUT_NEOPIXEL_IN
  Bottom 0.203: LED2.4-DIN 56.96,101.08 56.96,99 IC1.4
BUZZER_EN
  Bottom 0.203: U$2.2 77.96,60.67 | 77.28,58.97 R8.2 77.96,59.64 77.96,60.67 | Q4.1 arc81 77.28,64.42 77.28,62.21 77.96,61.53 77.96,60.67
CAP_SENSE_1  (via drill 0.25 pad 0.5)
  Top 0.203: v58.64,64.15 58.59,64.1 57.98,64.1 56.34,65.74 56.34,66.29
  Bottom 0.203: D3.1 57.08,64.99 57.68,64.99 | 57.68,64.99 R12.2 | 57.68,64.99 57.68,64.6 57.97,64.31 C65.1 58.57,63.89 | 58.57,63.89 59.26,63.89 R23.1 | 58.57,63.89 58.57,64.08 v58.64,64.15
  pour Top (no thermals): 48.37,73.78 56.36,65.79 64.36,73.78 56.36,81.77
CAP_SENSE_2  (via drill 0.25 pad 0.5)
  Bottom 0.152: R13.2 43.71,79.85 v43.71,79.39
CC1
  Bottom 0.152: X1.A5 57.56,8.38 60.34,11.16 60.34,13.15 R10.2
CC2
  Bottom 0.152: X1.B5 54.56,9.06 52.41,11.21 R9.2
D2  (via drill 0.25 pad 0.5)
  Route2 0.203: v36.66,74.63 36.66,76.29 v36.77,76.4
  Bottom 0.203: U1.45 46.88,80.25 46.13,80.25 45.89,80.01 45.89,79.25 44.98,78.34 41.7,78.34 41.05,78.99 40.2,78.99 39.97,78.76 39.97,77.14 39.16,76.33 36.7,76.33 v36.77,76.4 | R16.2 36.69,74.6 v36.66,74.63
D4_NEOPIXEL_EXT_5V_EN  (via drill 0.25 pad 0.5)
  Route2 0.203: v50.98,34.47 51.11,34.6 52.17,34.6 53.59,36.02 53.59,51.27 50.72,54.14 50.72,64.23 50.34,64.61 v50.34,69.09
  Bottom 0.203: U1.52 52.31,82.07 50.34,80.1 v50.34,69.09 | v50.98,34.47 50.8,34.29 50.8,33.76 Q2.1
D5_SPEAKER_EN  (via drill 0.25 pad 0.5)
  Route2 0.203: v59.88,80.32 59.88,81.29 60.54,81.95 65.13,81.95 65.53,81.55 70.2,81.55 v70.26,81.61
  Bottom 0.203: U1.53 53.31,82.34 55.35,80.3 59.86,80.3 v59.88,80.32 | U6.1 71.59,82.94 v70.26,81.61
GND  (via drill 0.25 pad 0.5, 0.35)
  Top 0.203: v58.05,37.74 v58.05,34.39
  Top 0.4: v77.08,86.3 76.34,86.3 v76.32,86.28
  Bottom 0.152: 45.91,63.13 45.35,63.13 45.24,63.13 | 45.89,61.14 45.41,61.14 45.31,61.14 | 48.31,61.21 48.78,61.21 48.91,61.21 | 48.81,62.96 48.35,62.96 | C58.2 69.86,88.71 v69.98,88.83
  Bottom 0.203: S1.3 37.07,78.05 v36.97,77.96 | S1.4 37.71,81.83 v37.71,82.93 | S2.4 37.01,69.6 v36.82,69.42 | S2.3 37.74,64.75 v37.71,64.73 | R10.1 v60.11,15.63 | R9.1 v52.41,15.73 | 56.31,52.13 56.21,52.03 U3.2 56.31,53.53 v56.81,54.03 | v56.81,55.03 v56.81,56.03 v55.81,56.03 v55.81,55.03 | v59.64,81.9 59.55,81.81 | R19.1 42.08,82.65 v42.17,82.74 | v34.61,74.67 v34.62,74.66 C62.1 34.74,73.61 34.74,72.6 35.04,72.3 U4.1 | U1.71 52.81,79.46 v52.77,79.5 | U1.65 61.18,78.28 v61.26,78.36 | v64.56,52.35 65.61,52.35 C55.1 | R25.2 60.86,65.29 v60.69,65.12 | C66.1 58.56,62.69 v58.54,62.71 | U7.2 62.61,60.55 v62.63,60.53 | v64.73,63.49 64.92,63.3 C67.1 | C2.2 70.14,66.07 v70.66,66.59 | D3.2 56.38,65.95 C3.2 | 55.31,69.43 52.51,69.43 52.31,69.23 | v55.29,63.84 56.98,63.84 C65.2 | R8.1 78.61,57.77 v79.11,57.77 | v58.05,37.74 C68.2 v58.05,34.39 | Q2.2 50.66,31.85 v50.98,31.53 | C56.1 v53.71,33.78 | C34.1 v56.85,33.78 | D5.2 54.77,9.94 v54.62,10.09 | D4.2 v59.68,11.53 | v48.98,63.45 48.81,63.28 48.81,62.96 | v48.8,60.41 48.8,61.19 48.78,61.21 | U5.2 70.37,53.26 | 70.37,53.26 70.66,52.97 U8.1 | 70.37,53.26 70.37,53.42 v71.01,54.07 | 48.35,62.96 48.35,62.81 | U2.5 v47.11,64.53 | 45.35,63.13 44.99,62.77 44.99,61.12 | 44.99,61.12 44.99,59.76 v45.71,59.04 v45.71,59.03 R6.1 46.56,59.7 47.24,60.38 | 45.41,61.14 45.39,61.12 44.99,61.12
  Bottom 0.4: U6.9 73.81,84.45 74.14,84.12 U6.7 76.85,84.12 77.34,83.63 C63.2 77.34,82.67 C51.2 76.93,82.18 76.51,81.76 v76.51,81.37 | C50.2 77.33,86.3 v77.08,86.3 | v73.27,85.81 73.39,85.69 73.39,83.09 v73.22,82.92 | v74.27,82.93 74.09,83.11 74.09,85.5 74.23,85.64 v74.23,85.89 74.23,86.42 C53.1
  Bottom 0.406: C64.1 65.95,66.22 66.24,66.51 v66.24,66.63 66.24,66.91 v65.73,67.42 65.73,67.1 v65.13,66.5 65.13,65.87 R41.2 | Q4.2 78.17,63.52 78.17,62.76 v78.48,62.45
  Bottom 0.508: U1.13 63.66,70.28 63.61,70.23 | U1.25 55.31,69.43 | U1.28 52.31,69.23 52.21,69.33 | U1.37 49.06,72.28 49.11,72.33 | U1.39 49.06,74.28 49.11,74.33 | U1.4 64.46,79.28 63.91,79.83 | U1.59 59.31,82.03 | v59.64,81.9 59.44,81.9 59.31,82.03 | IC1.3 v53.41,98.83 | IC1.1 v53.41,96.93 | C6.1 v59.01,99.53 | 59.31,82.03 59.19,81.91 v58.92,81.91 | v45.09,30.88 44.99,30.77 43.79,30.77 43.64,30.62 LED24.3-GND
  Bottom 0.61: C5.1 v54.61,108.33 | v61.48,114.3 61.41,114.37 C10.1 | LED4.3-GND 53.62,118.54 v52.11,118.54 | C11.1 v54.71,136.03 | v55.61,128.13 55.56,128.18 LED5.3-GND | v39.41,120.93 C9.1 | LED3.3-GND v47.21,117.23 | C12.1 71.31,123.25 v71.31,123.33 | LED6.3-GND 65.49,119.15 v64.71,118.63 | v68.81,96.93 LED7.3-GND | C13.1 72.74,103.8 v72.31,104.23 | v78.62,89.63 78.67,89.51 79.56,88.18 | C14.1 v85.51,92.73 | v90.71,94.53 LED10.3-GND | C22.1 97.31,99.25 v97.31,99.43 | v102.71,101.53 LED11.3-GND | C23.1 v109.21,106.43 | v109.21,106.43 | v99.41,88.43 LED12.3-GND | v106.81,84.93 106.39,84.5 C24.1 | 89.6,71.24 v89.55,71.19 | v81.34,61.71 81.02,61.71 80.36,61.04 80.36,60.94 | v91.41,54.33 LED16.3-GND | C28.1 98.39,50.3 98.81,50.73 v98.81,50.93 | v103.41,47.33 LED17.3-GND | v110.71,44.03 110.39,43.7 110.39,43.38 C29.1 | v91.51,35.83 C30.1 | LED18.3-GND v90.51,44.13 | v75.36,49.19 75.37,49.16 73.89,48.41 | v72.81,26.93 72.39,26.5 C33.1 | LED21.3-GND v65.41,30.33 | v57.11,47.63 LED20.3-GND | v58.01,39.33 C32.1 | LED22.3-GND 61.05,29.08 v61.02,29.07 | v58.35,32.75 58.13,32.53 C34.1 | LED23.3-GND v57.11,19.53 | v57.91,11.73 C35.1 | v40.97,26.78 40.97,26.85 40.98,26.87 C36.1 | v43.91,50.73 LED25.3-GND | v40.51,43.43 40.09,43.85 C37.1 | LED26.3-GND v33.91,60.13 | C38.1 v27.11,54.93 | v21.91,53.03 LED28.3-GND | v15.31,48.13 15.23,48.18 C40.1 | LED29.3-GND v9.51,46.03 | LED30.3-GND v13.21,58.83 | C42.1 6.24,62.75 5.81,62.33 v5.81,62.23 | LED31.3-GND 24.78,71.18 v24.41,71.03 | C43.1 31.51,76.73 v32.11,77.33 | v7.41,82.13 7.41,82.3 C45.1 | LED33.3-GND v14.01,87.13 | LED32.3-GND v33.21,86.33 | v25.51,89.93 C44.1 | v21.21,93.33 LED34.3-GND | C46.1 v13.81,96.53 | v13.81,96.53
  Bottom 0.61: v8.71,100.33 LED35.3-GND | C47.1 v1.41,103.53 | v1.41,103.53 | LED36.3-GND v22.11,103.53 | C48.1 v21.21,111.63 | LED37.3-GND v42.51,96.13 | C49.1 37.88,102.63 v37.81,102.63 | v2.81,41.33 2.81,41.43 C41.1 | v24.51,36.13 C39.1 | v23.61,44.13 23.56,44.13 LED27.3-GND | C15.1 v88.11,111.83 | LED9.3-GND 89.06,103.58 v89.11,103.53 | LED15.3-GND 99.49,60.65 v98.71,60.13 | v105.21,64.83 C27.1 | v55.87,64.44 55.86,64.45 C3.2 55.86,65.98 55.31,66.53 U1.25 | v51.71,64.33 51.66,64.38 C4.2 51.66,66.08 52.31,66.73 U1.28 | v69.12,82.57 68.94,82.75 C1.2 67.41,82.28 U1.1 | U1.15 65.73,68.26 v65.73,67.42 | U1.13 v63.7,70.28 v63.69,70.27 | v69.84,64.29 69.84,64.23 70.65,63.43 | v67.62,61.92 67.62,61.03 67.79,60.87 68.72,61.8 | v40.91,62.33 41.59,61.65 J1.1 40.71,60.73 v40.68,60.73 | C7.2 v52.11,60.93 | C8.2 52.09,62.5 v52.11,62.53 | X1.A1B12 59.51,8.53 v59.81,8.83 | X1.B1A12 53.11,8.33 v52.61,8.83 | v55.58,100.03 55.56,100.04 LED2.3-GND
  Bottom 0.813: v64.51,53.53 63.26,53.53 C20.2 | C19.2 50.71,53.98 v49.53,53.98 | v58.01,54.03 56.91,54.03 | v54.71,53.93 54.81,54.03 v55.81,54.03 | C21.- 53.76,60.43 53.61,60.58 v53.61,61.63 | C21.- 54.81,59.88 v54.81,59.13 | v54.81,61.63 54.81,60.98 C21.- | v53.61,59.13 53.61,60.13 53.97,60.13 C21.-
  other vias: 81.3,63.95 48.17,25.82 91.6,74.39 76.58,46.42 60.81,8.83 58.91,8.83 61.61,53.33 60.71,53.33 59.81,53.33 63.61,52.43 62.61,52.33 51.36,52.55 49.5,53.12 52.48,53.32 53.31,53.23 72.88,88.65 53.61,8.83 51.61,8.83 64.41,68.63 48.41,68.93 48.71,81.43 58.31,1.03 54.31,0.93 56.31,1.03 57.31,1.83 55.31,1.83 32.71,63.53 41.26,52.11 67.68,50.88 52.31,68.75 92.32,87.24 96.89,84.58 102.11,81.57 87.36,86.86 76.12,88.52 82.38,83.96 39.2,118.27 44.75,115.48 50.24,112.8 56.15,112.7 43.54,124.77 48.36,121.82 52.7,129.47 52.53,134.41 60.54,134.54 60.57,129.6 63.84,120.65 68.76,123.79 66.15,115.83 71.27,118.64 72.39,116.92 67.12,113.91 62,111.05 69.86,104.03 66.92,99.25 74.8,101.07 72.23,96.53 73.84,95.67 76.36,100.25 86.38,109.48 86.47,103.43 86.6,97.76 93.98,103.62 94.02,109.7 91.5,103.46 99.17,102.82 105.89,106.93 110.37,100.31 101.85,97.92 109.5,102.34 103.01,96.01 100.9,90.72 106.32,87.8 103.17,82.8 97.95,86.57 92.54,91.6 83.01,93.86 78.37,91.01 81.27,85.79 86.11,88.45 73.37,90.84 82.52,78.04 87.37,78.03 81.79,69.39 86.13,69.41 102.64,65.92 95.57,61.45 86.41,60.6 98.42,57.57 106.57,59.62 100.08,55.69 91.09,57.49 102.13,51.62 109.08,47.47 99.02,46.52 107.08,41.76 93.6,42.64 93.59,37.35 97.76,45.04 106.01,40.26 87.52,42.7 87.75,37.22 85.66,37.18 85.62,42.66 85.7,50.45 91.07,50.68 85.12,54.36 77.84,56.52 84.16,52.74 73.53,52.64 69.26,43.36 74.26,42.63 68.85,56.26 64.77,58.48 65.51,50.81 62.04,50.05 60.68,48.53 60.7,47.65 60.72,46.78 60.73,45.87 60.75,44.98 60.75,43.88 60.79,42.65 60.77,41.4 60.78,40.19 60.79,39.04 60.76,37.84 60.68,35 60.74,33.78 60.78,32.72 60.84,31.43 59.07,35.1 59.07,33.8 59.06,32.75 59.04,31.64 59.08,36.44 59.07,37.59 59.11,40.41 59.05,41.43 59.03,42.64 59.02,43.89 59,44.96 58.99,45.98 59.01,46.78 59.01,47.68 64.77,59.47 64.8,57.4 66.58,61.16 66.39,63.58 69,70.84 69.02,69.69 69.03,67.06 68.99,72.43 69.02,73.84 69.06,75.31 66.96,74.74 66.96,73.72 66.94,72.44 66.99,77.19 64.25,77.39 63.51,78.11 62.33,78.48 62.58,80.25 63.81,80.17 51.91,47.63 51.97,43.85 52.02,39.17 48.74,35.88 44.31,33.32 38.93,30.06 42.01,22.32 64.79,34.35 72.34,29.94 61.31,27.55 68.88,23.06 69.93,24.61 62.46,30.04 45.99,49.38 42.63,43.99 38.04,47.07 36.44,48.17 39.37,53.2 27.41,59.74 30.09,54.38 36,57.69 31.37,64.34 26.38,61.56 22.18,59.52 16.94,56.43 9.05,64.83 14.81,61.39 16.07,63.1 10.25,66.53 5.82,59.81 11.58,56.58 10.71,52.42 1.75,47.28 2.71,45.47 5.84,40.36 11.26,43.57 6.94,50.26 15.82,46.12 20.35,49.38 26.5,44.2 26.44,37.31 20.25,37.58 20.25,44.14 18.35,44.2 18.5,37.58 24.5,77.61 20.45,73.8 29.57,69.33 29.59,73.02 30.47,84.08 33.68,89.5 24.85,87.41 28.64,92.75 15.65,84.58 10.08,81.45 6.9,86.24 5.72,88.14 11.29,91.53 16.2,94.33 11.14,95.76 7.2,98.4 1.73,101.1 4.72,105.94 10.23,102.76 6.17,107.47 11.41,104.44 16.27,100.13 22.14,96.99 18.72,103.5 18.7,109.67 25.02,109.7 26.99,109.7 26.94,103.64 24.83,103.63 22.69,113.69 36.36,100.2 39.57,94.99 44.96,98.35 41.61,103.54 43.26,104.82 46.49,99.48 52.39,101.68 34.47,82.78 38.29,87.27 41.51,87.5 41.51,90.29 44.23,90.46 44.33,87.34 67.83,94.16 67.54,90.02 67.54,85.34 48.72,75.51 76.95,73.97 73.55,81.18 70.45,77.58 76.84,66.8 45.2,62.41
  pour Top (isolate 0.2, rank 2): -4.58,-3.07 119.21,-3.07 119.21,139.73 -4.58,139.73
  pour Bottom (isolate 0.2, rank 2): -4.58,-3.07 119.21,-3.07 119.21,139.73 -4.58,139.73
  pour Bottom (isolate 0.1): 48.42,68.93 64.21,68.93 64.21,81.73 48.42,81.73
  pour Bottom (isolate 0.1, no thermals): 50.06,54.33 49.88,54.15 49.88,52.25 52.39,52.25 52.76,52.61 52.79,52.63 53.27,52.63 54.16,53.51 54.19,53.53 59.03,53.53 59.07,53.51 59.86,52.73 61.73,52.73 61.77,52.71 62.36,52.13 64.01,52.13 64.01,54.19 63.87,54.33 62.19,54.33 62.16,54.34 62.13,54.37 62.11,54.41 62.11,54.49 61.87,54.73 59.26,54.73 58.97,54.44 58.93,54.43 53.79,54.43 53.76,54.44 53.47,54.73 52.26,54.73 51.87,54.34 51.83,54.33
  cutout Bottom: 45.68,82.64 47.89,82.64 47.89,68.28 64.75,68.28 64.75,82.1 48.15,82.1 48.15,84.09 66.66,84.09 66.66,66.47 45.69,66.47 45.69,68.55 45.68,68.55
  pour Route2 (isolate 0.15): -5.19,140.56 119.71,140.56 119.71,108.62 119.71,-3.58 102.16,-3.58 -5.2,-3.58 -5.2,140.57
N$1
  Bottom 0.203: R6.2 48.16,59.33 48.16,60.61 47.56,61.21 U2.2
N$2
  Bottom 0.203: LED2.2-DOUT 55,106.48 | 55,106.48 54.26,106.48 | 52.91,107.83 52.91,107.97 | 52.91,107.97 52.91,114.73 48.49,119.15 LED3.4-DIN | 55,106.48 53.88,106.49 arc-75 52.97,107.2 arc-20 52.91,107.97
N$3
  Bottom 0.152: LED3.2-DOUT 41.59,120.45 | 41.59,120.45
  Bottom 0.203: 41.59,120.45 40.87,119.73 39.11,119.73 38.61,120.23 38.61,123.13 40.01,124.53 42.29,124.53 48.84,119.8 51.73,116.91 53.5,116.91 LED4.4-DIN
N$4
  Bottom 0.203: LED5.4-DIN 56.89,129.01 56.89,127.59 56.39,127.09 55.01,127.09 54.63,126.71 54.63,121.08 55.78,119.93 58.24,119.93 58.96,119.21 LED4.2-DOUT
N$5
  Bottom 0.152: LED6.4-DIN 66.29,117.75 | 66.29,117.75
  Bottom 0.203: LED5.2-DOUT 54.66,134.48 53.81,135.33 53.81,136.73 54.31,137.23 58.01,137.23 59.61,135.63 59.61,128.98 57.8,127.17 57.8,121.53 58.27,121.06 60.74,121.06 64.47,117.33 65.87,117.33 66.29,117.75
N$6
  Bottom 0.152: LED6.2-DOUT | LED7.4-DIN
  Bottom 0.203: LED6.2-DOUT 70.23,123.85 70.61,124.23 72.11,124.23 73.91,122.43 73.91,119.33 73.41,118.83 72.67,118.39 61.52,111.79 arc63 60.19,109.25 60.19,99.25 | LED7.4-DIN 69.71,96.23 arc-66 68.63,96 arc-27 67.64,96.67 arc42 67.04,96.97 61.93,96.97 arc-75 60.3,98.22 arc-17 60.19,99.25 | 60.19,99.14 60.19,99.25
N$7
  Bottom 0.203: LED7.2-DOUT 71.41,103.07 71.41,104.43 71.91,104.93 74.01,104.93 75.71,103.23 75.71,101.46 72.07,94.19 72.07,90.83 73.59,89.31 76.97,89.31 79.6,86.67 80.21,86.67 LED8.4-DIN | LED7.2-DOUT
N$8
  Bottom 0.152: LED8.2-DOUT
  Bottom 0.203: LED8.2-DOUT 83.73,91.3 83.73,92.25 90.56,99.08 LED9.4-DIN
N$9
  Bottom 0.406: LS1.- 73.81,76.33 72.04,74.56 72.04,67.25 73.24,66.05 D1.1 73.48,65.83 74.82,64.49 Q4.3
  Bottom 0.61: LS1.- 74.33,77.9
N$10
  Bottom 0.203: U3.1 57.81,51.18 R11.1
N$11
  Bottom 0.152: LED11.4-DIN | LED10.2-DOUT
  Bottom 0.203: LED11.4-DIN 104.09,100.85 103.86,100.62 arc-11 98.14,100.78 arc49 96.08,100.13 arc88 95.93,98.17 LED10.2-DOUT
N$12
  Bottom 0.152: LED11.2-DOUT
  Bottom 0.203: LED11.2-DOUT 108.23,106.65 108.91,107.33 109.61,107.33 111.71,105.23 111.71,103.23 111.07,102.59 99.17,94.23 arc52 98.31,92.68 98.31,87.53 99.34,86.5 LED12.4-DIN
N$13  (via drill 0.25 pad 0.5)
  Route2 0.203: v80.19,78.43 79.65,78.97 79.65,82.89 v80.68,83.92
  Bottom 0.152: LED12.2-DOUT | LED12.2-DOUT 105.09,85.25
  Bottom 0.203: 105.09,85.25 105.66,85.83 107.11,85.83 107.81,85.13 107.81,83.33 105.83,81.35 104.58,81.35 91.47,89.01 88.31,89.01 81.84,85.07 v80.68,83.92 | v80.19,78.43 81.31,77.31 84.73,77.31 LED13.4-DIN
N$14  (via drill 0.25 pad 0.5)
  Route2 0.203: v79.31,66.69 v80.3,69.53
  Bottom 0.203: LED13.2-DOUT 87.06,70.58 86.46,69.98 80.75,69.98 v80.3,69.53 80.21,69.53 | LED14.4-DIN 79.35,59.5 79.07,59.78 79.07,61.42 79.62,61.97 79.62,65.4 79.31,65.71 v79.31,66.69
N$15
  Bottom 0.152: LED15.4-DIN
  Bottom 0.203: LED15.4-DIN 99.83,58.79 85.62,58.79 LED14.2-DOUT
N$16
  Bottom 0.203: LED16.4-DIN 91.44,52.5 90.41,53.53 90.41,54.73 91.48,55.79 97.6,55.8 107.53,61.04 107.91,61.43 107.91,62.45 106.75,64.59 105.66,65.68 104.76,65.68 104.01,64.93 104.01,63.55 104.23,63.33 LED15.2-DOUT | LED15.2-DOUT
N$17
  Bottom 0.152: CONN1.1 66.89,59.62
  Bottom 0.203: D6.2 65.64,58.37 65.64,58.52 66.74,59.62 CONN1.1
N$18
  Bottom 0.152: D6.1 67.59,56.37 67.17,56.37
  Bottom 0.61: 67.59,56.37 67.17,56.37 R7.1
N$19
  Bottom 0.152: LED17.4-DIN
  Bottom 0.203: LED16.2-DOUT 97.76,51.93 99.31,51.93 101.81,49.43 101.81,47.33 LED17.4-DIN | LED16.2-DOUT
N$20
  Bottom 0.152: LED10.4-DIN
  Bottom 0.203: LED9.2-DOUT 88.16,109.98 87.21,110.93 87.21,112.33 87.91,113.03 91.71,113.03 92.71,112.03 92.71,99.43 89.71,96.43 89.71,94.03 90.41,93.33 91.87,93.33 LED10.4-DIN
N$21
  Bottom 0.203: LED24.2-DOUT 46.53,25.67 46.53,24.77 44.35,23.33 40.81,23.33 38.71,25.43 38.71,28.83 40.26,30.37 52.23,37.27 52.64,37.69 52.64,48.49 51.36,49.78 43.62,51.81 43.09,51.81 41.99,50.7 LED25.4-DIN | LED25.4-DIN
N$22
  Bottom 0.203: LED23.2-DOUT 58.06,13.18 58.81,12.43 58.81,11.3 58.24,10.73 54.41,10.73 53.71,11.43 53.71,19.43 54.65,20.37 54.65,26.36 54.31,26.7 53.62,26.7 52.04,28.28 52.04,34.81 51.51,35.34 49.91,35.34 49.13,34.89 42.2,30.9 42.03,30.73 42.03,30.06 LED24.4-DIN
N$23
  Bottom 0.203: LED23.4-DIN 55.56,19.74 56.33,20.5 57.51,20.5 57.97,20.96 57.97,26.28 56.6,27.65 54.4,27.65 53.66,28.39 LED22.2-DOUT
N$24
  Bottom 0.203: LED21.2-DOUT 71.66,27.83 73.31,27.83 74.01,27.13 74.01,25.13 72.31,23.43 70.35,23.43 63.63,27.79 60.21,30.58 LED22.4-DIN | LED21.2-DOUT
N$25
  Bottom 0.203: LED21.4-DIN arc-90 65.08,28.5 64.43,29.16 58.23,40.77 arc61 57.53,41.18 LED20.2-DOUT
N$26
  Bottom 0.203: LED19.2-DOUT 68.69,45.15 67.11,46.73 65.05,50.19 64.54,50.81 61.51,50.81 60.65,50.59 58.5,48.49 58.37,48.43 56.51,48.43 55.56,47.48 LED20.4-DIN
N$27
  Bottom 0.203: LED18.2-DOUT 91.26,37.68 92.41,36.53 92.41,35.13 91.91,34.63 87.61,34.63 86.72,35.52 86.72,51.64 86.11,52.25 77.52,57.62 74.73,57.62 72.64,55.53 72.52,55.23 72.52,54.66 72.65,54.27 73.1,50.13 73.1,49.93 LED19.4-DIN
N$28
  Bottom 0.203: LED25.2-DOUT 41.51,44.28 41.51,43.03 40.91,42.43 39.11,42.43 36.91,44.63 36.91,46.95 40.66,53.86 40.66,54.88 34.31,61.23 32.66,61.23 LED26.4-DIN | LED26.4-DIN | LED25.2-DOUT
N$29
  Bottom 0.152: LED26.2-DOUT
  Bottom 0.203: LED26.2-DOUT 28.39,54.96 22.06,48.63 LED27.4-DIN
N$30
  Bottom 0.152: LED28.4-DIN
  Bottom 0.203: LED27.2-DOUT 24.46,37.68 25.51,36.63 25.51,35.63 24.61,34.73 20.51,34.73 19.41,35.83 19.41,47.33 23.61,51.53 23.61,52.83 22.11,54.33 20.76,54.33 LED28.4-DIN
N$31
  Bottom 0.152: LED29.4-DIN | LED28.2-DOUT
  Bottom 0.203: LED28.2-DOUT 16.19,49.65 16.19,47.91 15.01,46.73 10.61,46.73 9.71,47.63 8.56,47.63 LED29.4-DIN
N$32
  Bottom 0.152: 4.02,42.73 | LED30.4-DIN
  Bottom 0.203: LED30.4-DIN 13.69,60.65 14.81,59.53 14.81,55.86 14.13,53.42 1.56,45.97 0.51,44.93 0.51,42.53 2.51,40.53 3.41,40.53 4.29,41.41 4.29,42.45 4.02,42.73 LED29.2-DOUT
N$33
  Bottom 0.203: LED30.2-DOUT 6.87,61.23 5.31,61.23 4.71,61.83 4.71,63.73 6.91,65.93 9.5,65.93 21.74,58.94 23.31,58.94 32.65,64.27 33.01,64.63 33.01,68.23 31.21,70.03 28.21,70.03 LED31.4-DIN | LED30.2-DOUT
N$34
  Bottom 0.152: LED32.4-DIN
  Bottom 0.203: LED31.2-DOUT 25.56,77.28 26.31,78.03 31.72,78.03 32.96,79.26 32.96,84.77 33.85,85.66 33.85,87.29 LED32.4-DIN
N$35
  Bottom 0.152: LED32.2-DOUT 27.59,89.45 | 27.59,89.45 | LED33.4-DIN
  Bottom 0.203: 27.59,89.45 26.47,88.33 12.76,88.33 LED33.4-DIN
N$36
  Bottom 0.152: LED17.2-DOUT | LED17.2-DOUT 109.04,44.2
  Bottom 0.203: 109.04,44.2 109.66,44.83 111.31,44.83 111.61,44.53 111.61,42.13 109.71,40.23 108.3,40.23 96.26,46.89 arc77 91.21,46.03 89.06,43.88 LED18.4-DIN
N$37
  Bottom 0.152: LED35.4-DIN 8.51,102.15 | LED34.2-DOUT
  Bottom 0.203: LED34.2-DOUT 14.57,95.43 13.7,95.43 11.18,97.16 10.47,97.87 10.47,100.21 9.07,101.61 9.05,101.61 8.51,102.15
N$38
  Bottom 0.152: LED35.2-DOUT
  Bottom 0.203: LED35.2-DOUT 2.17,102.53 1.31,102.53 0.61,103.23 0.61,105.33 2.41,107.13 4,107.13 14.62,101.33 22.21,101.33 23.56,102.68 LED36.4-DIN
N$39
  Bottom 0.152: LED37.4-DIN
  Bottom 0.203: LED36.2-DOUT 21.36,109.98 20.21,111.13 20.21,112.13 20.91,112.83 24.51,112.83 25.81,111.53 25.81,96.43 26.52,95.72 35.29,90.03 38.21,90.03 38.41,90.23 43.51,95.33 43.51,97.68 LED37.4-DIN
N$40
  Bottom 0.152: LED34.4-DIN | LED33.2-DOUT
  Bottom 0.203: LED33.2-DOUT 8.39,81.71 7.91,81.23 7.11,81.23 5.27,83.07 4.91,84.38 4.91,85.73 5.55,86.36 12.14,89.43 19.11,89.43 22.34,92.66 22.34,93.8 LED34.4-DIN
N$41
  Bottom 0.152: R17.1 70.97,88.46 C52.1
N$42
  Bottom 0.203: U6.4 70.97,86.04 R17.2
N$43
  Bottom 0.203: R16.1 35.75,73.53 36.14,73.14 36.64,73.14 37.07,72.71 37.07,71.18 37.19,71.06 R18.1 36.58,71.06 U4.2
N$44
  Bottom 0.203: Q2.3 47.96,32.97 46.92,31.93 46.92,29.46 47.44,28.94 Q3.1 48.85,27.9 R21.1
N$45
  Bottom 0.203: 51.12,28.56 51.12,28.38 51.12,27.89 C61.2 | C60.2 51.49,26.92 51.52,26.89
  Bottom 0.813: +5V_EX.P$1 53.01,25.4 | 51.12,27.88
  Bottom 1: Q3.3 51.12,29.77 51.12,28.56 51.12,27.88 51.12,27.29 | 53.01,25.4 51.52,26.89 51.12,27.29 | 51.12,27.17 51.12,27.29
N$46
  Bottom 0.152: R15.1 C58.1
N$47
  Bottom 0.203: U6.3 70.4,84.77 R15.2
N$48  (via drill 0.25 pad 0.5)
  Route2 0.203: v43.2,83.05 43.2,95.85 44.34,96.99 51.5,96.99 51.51,96.98 51.56,96.98 52.55,97.97 61.01,97.97 61.65,97.33 67.15,97.33 68.87,95.61 v71.19,95.61 v71.2,95.62
  Bottom 0.203: R66.2 R14.2 43.93,83.05 v43.2,83.05 | v71.2,95.62 71.2,89.63 C52.2
N$49
  Bottom 0.203: U6.2 69.9,84.12 C59.1
N$50
  Bottom 0.203: R23.2 C66.2 60.26,62.42 60.95,61.73 U7.3
N$51
  Bottom 0.203: R24.2 59.87,64.54 60.62,64.54 60.94,64.22 60.94,63.34 61.53,62.75 63.19,62.75 63.57,62.37 U7.1
N$52
  Bottom 0.203: U7.4 61.68,64.29 61.68,65.06 61.8,65.18 R25.1
N$54
  Bottom 0.203: U7.6 63.57,65.75 R26.1
NEOPIXEL_BUFF_IN  (via drill 0.25 pad 0.5)
  Route2 0.203: v40.59,78.34 40.59,80.55 v40.51,80.63
  Bottom 0.203: U$15.2 42.68,76.41 42.15,76.41 40.59,77.97 v40.59,78.34 | IC1.2 53.46,97.88 52.2,96.62 44.7,96.62 44.31,96.23 44.31,94.05 40.51,90.25 v40.51,80.63
NEOPIXEL_DATA  (via drill 0.25 pad 0.5)
  Route2 0.203: v54.27,100.73 58.79,100.73 v58.91,100.61 | v42.31,93.23 v40.91,94.63
  Bottom 0.203: 55.96,25.15 55.96,22.33 56.11,22.47 56.11,23.85 | 52.58,32.98 52.58,28.51 53.93,27.16 55.37,27.16 56.11,26.42 56.11,23.85 | 52.58,32.98 52.58,34.37 53.25,35.04 53.25,49.09 52.31,50.03 44.1,52.41 43.07,53.2 33.51,62.76 33.51,68.53 31.25,70.79 31.25,75.08 33.51,77.34 33.51,84.43 v42.31,93.23 | LED37.2-DOUT 39.03,101.75 38.21,100.93 | 38.21,100.93 38.21,98.75 v40.91,94.63 | C56.2 52.58,32.98 | DATA1.P$1 56.31,123.85 56.31,121.2 56.87,120.64 60.15,120.64 63.74,117.05 63.74,114.91 59.58,110.75 59.58,101.28 v58.91,100.61 | v54.27,100.73 53.13,100.73 52.44,100.04 52.44,99.17 arc-103 50.93,97.27 47.32,97.27 41.46,105.26 38.78,105.26 36.98,103.46 36.98,101.71 37.76,100.93 38.21,100.93 | DATA.P$1 56.11,23.85
P2_!MODE
  Bottom 0.203: S1.1 39.29,79.43 | 39.29,79.43 39.29,79.44 | 39.29,79.44 S1.2 | 39.29,79.43 36.16,79.43 R4.1 | 39.29,79.44 41.32,79.44 41.96,78.8 44.76,78.8 45.48,79.52 45.48,80.35 46.26,81.13 46.76,81.13 U1.46
P2_!RESET  (via drill 0.25 pad 0.5)
  Route2 0.203: v46.43,56.23 46.43,65.06 46.68,65.31 46.68,66.98 45.43,68.23 v45.11,68.23 41.81,68.23 v41.21,67.63
  Bottom 0.203: S2.1 39.29,67.13 | 39.29,67.13 39.29,67.63 | 39.29,67.63 S2.2 39.29,70.37 39.04,70.62 R18.2 | R5.1 39.24,67.08 39.29,67.13 | 39.29,67.63 v41.21,67.63 | v45.11,68.23 46.16,69.28 U1.34 | v46.43,56.23 46.43,53.37 47.7,52.11 52.49,50.82 54.31,49 58.18,49 60.57,51.39 68.19,51.39 68.61,50.97 68.61,50.17 69.41,49.37 69.95,49.37 71.42,50.84 | U8.2 72,51.42 71.42,50.84 | 71.42,50.84 71.31,50.84 68.47,53.68 U5.1 68.62,55.16 68.89,55.42 70.88,55.42 74.55,59.1 74.55,59.52 CONN1.10 75.23,61.92 TP1.TP
P2_A0_PDM_MIC_CLK
  Bottom 0.203: U1.50 50.31,83.83 49.91,84.23 47.71,84.23 47.44,83.96 44.11,83.96 43.76,84.31 U$4.1
P2_A1_PDM_MIC_DATA
  Bottom 0.203: U1.43 46.01,78.28 U$3.1
P2_A5
  Bottom 0.203: 57.36,67.38 U1.23 57.31,66.77 58.15,65.93 R12.1
P2_D0_SDA
  Bottom 0.203: U1.36 46.06,71.28 43.97,69.19 43.97,61.16 J1.3
P2_D1_SCL
  Bottom 0.203: U1.35 46.06,70.28 44.42,68.64 44.42,60.23 43.76,59.56 J1.4
P2_D6_SWCLK  (via drill 0.25 pad 0.5)
  Route2 0.203: v60.79,81.37 60.83,81.33 64.95,81.33 73.61,72.67 TP7.TP
  Bottom 0.203: TP7.TP 73.61,62.99 70.18,59.56 70.18,58.73 70.75,58.17 70.75,57.94 CONN1.4 | U1.55 55.31,81.73 55.85,81.2 60.62,81.2 v60.79,81.37
  other vias: 73.61,63.53
P2_D7_SWDIO  (via drill 0.25 pad 0.5)
  Route2 0.203: TP8.TP 73.08,66 73.08,72.45 64.7,80.83 61.08,80.83 v60.82,80.57
  Bottom 0.203: TP8.TP 72.44,64.5 72.44,62.56 69.36,59.48 69.36,57.76 69.85,57.27 69.85,57.04 CONN1.2 | U1.54 54.31,82.22 55.71,80.83 60.56,80.83 v60.82,80.57
  other vias: 72.01,64.93
P2_RGB_B  (via drill 0.25 pad 0.5)
  Route2 0.203: v42.11,66.03 v45.91,66.03
  Bottom 0.203: U1.31 49.31,66.53 48.81,66.03 v45.91,66.03 | R3.2 42.16,66.08 v42.11,66.03
P2_RGB_G  (via drill 0.25 pad 0.5)
  Route2 0.203: v42.81,66.93 v45.1,66.93 v45.11,66.94
  Bottom 0.203: U1.32 48.31,67.13 48.12,66.94 v45.11,66.94 | R2.2 42.21,73.83 43.11,72.93 43.11,67.23 v42.81,66.93
P2_RGB_R  (via drill 0.25 pad 0.5)
  Route2 0.203: v42.81,65.13 45.02,65.13 v45.11,65.22
  Bottom 0.203: U1.29 51.31,67.03 49.45,65.16 45.17,65.16 v45.11,65.22 | R1.2 43.51,73.98 43.51,65.83 v42.81,65.13
P2_RX/D9
  Bottom 0.152: U1.63 63.31,82.73 63.93,82.11 64.67,82.11 64.86,82.3 64.86,82.72 65.31,83.17 67.05,83.17 68.66,84.78 68.66,90.2 69.51,91.05 TP6.TP
P2_S0_MOSI
  Bottom 0.203: U1.40 45.31,75.28 U$15.1
P2_S1_SO_SPEAKER  (via drill 0.25 pad 0.5)
  Route2 0.203: v67.04,51.89 69.87,54.72 v70.43,54.72 | v47.06,54.4 47.06,63.19 48.62,64.75 48.62,67.3 45.15,70.77 v45.15,76.36
  Bottom 0.203: v45.15,76.36 45.23,76.28 U1.41 | v47.06,54.4 47.06,53.7 47.88,52.88 | 47.95,52.88 47.88,52.88 | 47.88,52.88 48.3,52.47 52.85,51.28 52.9,51.28 54.71,49.47 57.69,49.47 59.97,51.74 66.97,51.74 67.17,51.95 67.1,51.95 v67.04,51.89 | U$2.1 76.27,60.09 76.27,60.02 71.08,54.83 70.55,54.83 v70.43,54.72
P2_S4
  Bottom 0.203: R13.1 44.8,80.28 45.93,81.4 45.93,82.08 46.12,82.28 U1.47
P2_TX/D8
  Bottom 0.152: U1.64 64.31,83.33 64.62,83.64 66.95,83.64 68.11,84.8 68.11,92.54 TP5.TP
P2_VBAT_MEAS
  Bottom 0.203: U1.12 66.72,71.28 66.89,71.11 C64.2 66.89,64.72 66.85,64.67 R22.2 65.13,64.57 R41.1
P2_WKP/D10  (via drill 0.25 pad 0.5)
  Route2 0.203: v60.14,65.93 60.35,66.14 v60.35,68.83
  Bottom 0.203: U1.30 50.31,68.14 51.27,69.1 51.27,69.55 51.86,70.14 59.6,70.14 60.35,69.39 v60.35,68.83 | v60.14,65.93 R24.1
PDM_MIC_CLK  (via drill 0.25 pad 0.5)
  Route2 0.203: v41.37,82.89 41.37,69.76 41.29,69.68 41.27,69.68 39.97,68.38 39.97,66.11 45.59,60.49 v45.59,60.19
  Bottom 0.203: U$4.2 41.57,84.25 41.57,84.04 41.37,83.84 v41.37,82.89 | U2.3 46.66,61.14 45.71,60.19 v45.59,60.19
PDM_MIC_DATA  (via drill 0.25 pad 0.5)
  Route2 0.203: v45.31,64.13 42.76,64.13 40.5,66.39 40.5,67.88 41.94,69.32 41.95,69.32 41.95,77.14 v42.15,77.34
  Bottom 0.203: v42.15,77.34 42.24,77.43 U$3.2 | U2.4 46.66,63.05 45.58,64.13 v45.31,64.13
RGB_B
  Bottom 0.203: R3.1 40.56,72.03 38.31,72.03 37.96,72.38 LED1.BLUE
RGB_G
  Bottom 0.203: R2.1 40.11,73.08 LED1.GREEN
RGB_R
  Bottom 0.203: R1.1 40.11,74.58 LED1.RED
S5/AUDIO_R
  Bottom 0.152: U1.48 48.07,83.37 45.19,83.37 R14.1
S6/AUDIO_L  (via drill 0.25 pad 0.5)
  Route2 0.203: v47.06,67.51 47.06,67.89 44.31,70.64 44.31,81.28 v44.44,81.41
  Bottom 0.203: R66.1 44.92,81.89 v44.44,81.41 | v47.06,67.51 47.02,67.55 47.02,68.17 U1.33
SPEAKER_N_L
  Bottom 0.4: U6.8 75.71,83.19 75.71,81.97 | TP9.P$1 81.89,73.66 78.61,76.94 | 75.71,81.97 75.71,79.84 78.36,77.19 78.61,76.94 | C54.1 75.7,81.98 75.71,81.97 | U$1.LEAD- 78.61,76.94
SPEAKER_P_L
  Bottom 0.4: U6.5 75.7,85.42 75.56,85.56 75.56,86.76 C53.2 75.79,87.04 78,87.04 79.44,85.6 79.44,80.53 78.84,79.93 U$1.LEAD+ 78.61,78.39 80.82,76.18 TP10.P$1
USB_N  (via drill 0.25 pad 0.5)
  Route2 0.203: v57.25,9.03 57.25,9.43 59.07,11.26 59.07,19.47 57.01,21.53 57.01,25.76 57.49,26.24 58.88,26.24 60.07,27.43 60.07,49.29 61.51,50.73 64.47,50.73 65.82,52.08 65.82,64.73 68.22,67.13 68.22,75.02 63.83,79.42 63.41,79.42 63.13,79.7 v63.13,79.74
  Bottom 0.152: X1.B7 57.06,6.38 56.91,6.23 56.21,6.23 56.06,6.38 X1.A7
  Bottom 0.203: X1.B7 57.06,8.58 56.97,8.67 56.97,8.75 v57.25,9.03 57.25,9.85 D4.1 | v63.13,79.74 62.85,79.46 62.41,79.46 62.01,79.86 62.01,82.53 62.31,82.83 U1.62
USB_P  (via drill 0.25 pad 0.5)
  Route2 0.203: v56.34,9.03 58.71,11.4 58.71,19.33 56.65,21.39 56.65,25.91 57.34,26.6 58.73,26.6 59.71,27.58 59.71,49.44 61.36,51.09 64.32,51.09 65.45,52.22 65.45,64.87 67.86,67.28 67.86,74.88 63.69,79.05 63.33,79.05 v63.11,78.83
  Bottom 0.152: X1.A6 56.56,7.88 56.31,8.13 55.81,8.13 55.56,7.88 X1.B6
  Bottom 0.203: X1.A6 56.56,8.58 56.61,8.63 56.61,8.75 v56.34,9.03 56.34,9.83 D5.1 | v63.11,78.83 62.84,79.1 62.27,79.1 61.66,79.71 61.66,82.53 61.31,82.87 U1.61
(copper drawn outside any net)
  shapes: Bottom area x1, Route15 area x1, Route2 area x1, Top area x1

## Text on the board
bPlace: SNOWFLAKE v0.0.2 | TX | RX | MODE | ♫ | RESET | MIC | QWIIC | +5V | D | GND
bNames: LED1 | U3
bValues: P2 | FS-1340 | RBG | XC6220B331 | TYPE-C USB